# EAGLE design ZORRO-LAN-IDE (EAGLE 6.6.0)

## Sheet 1 of 2
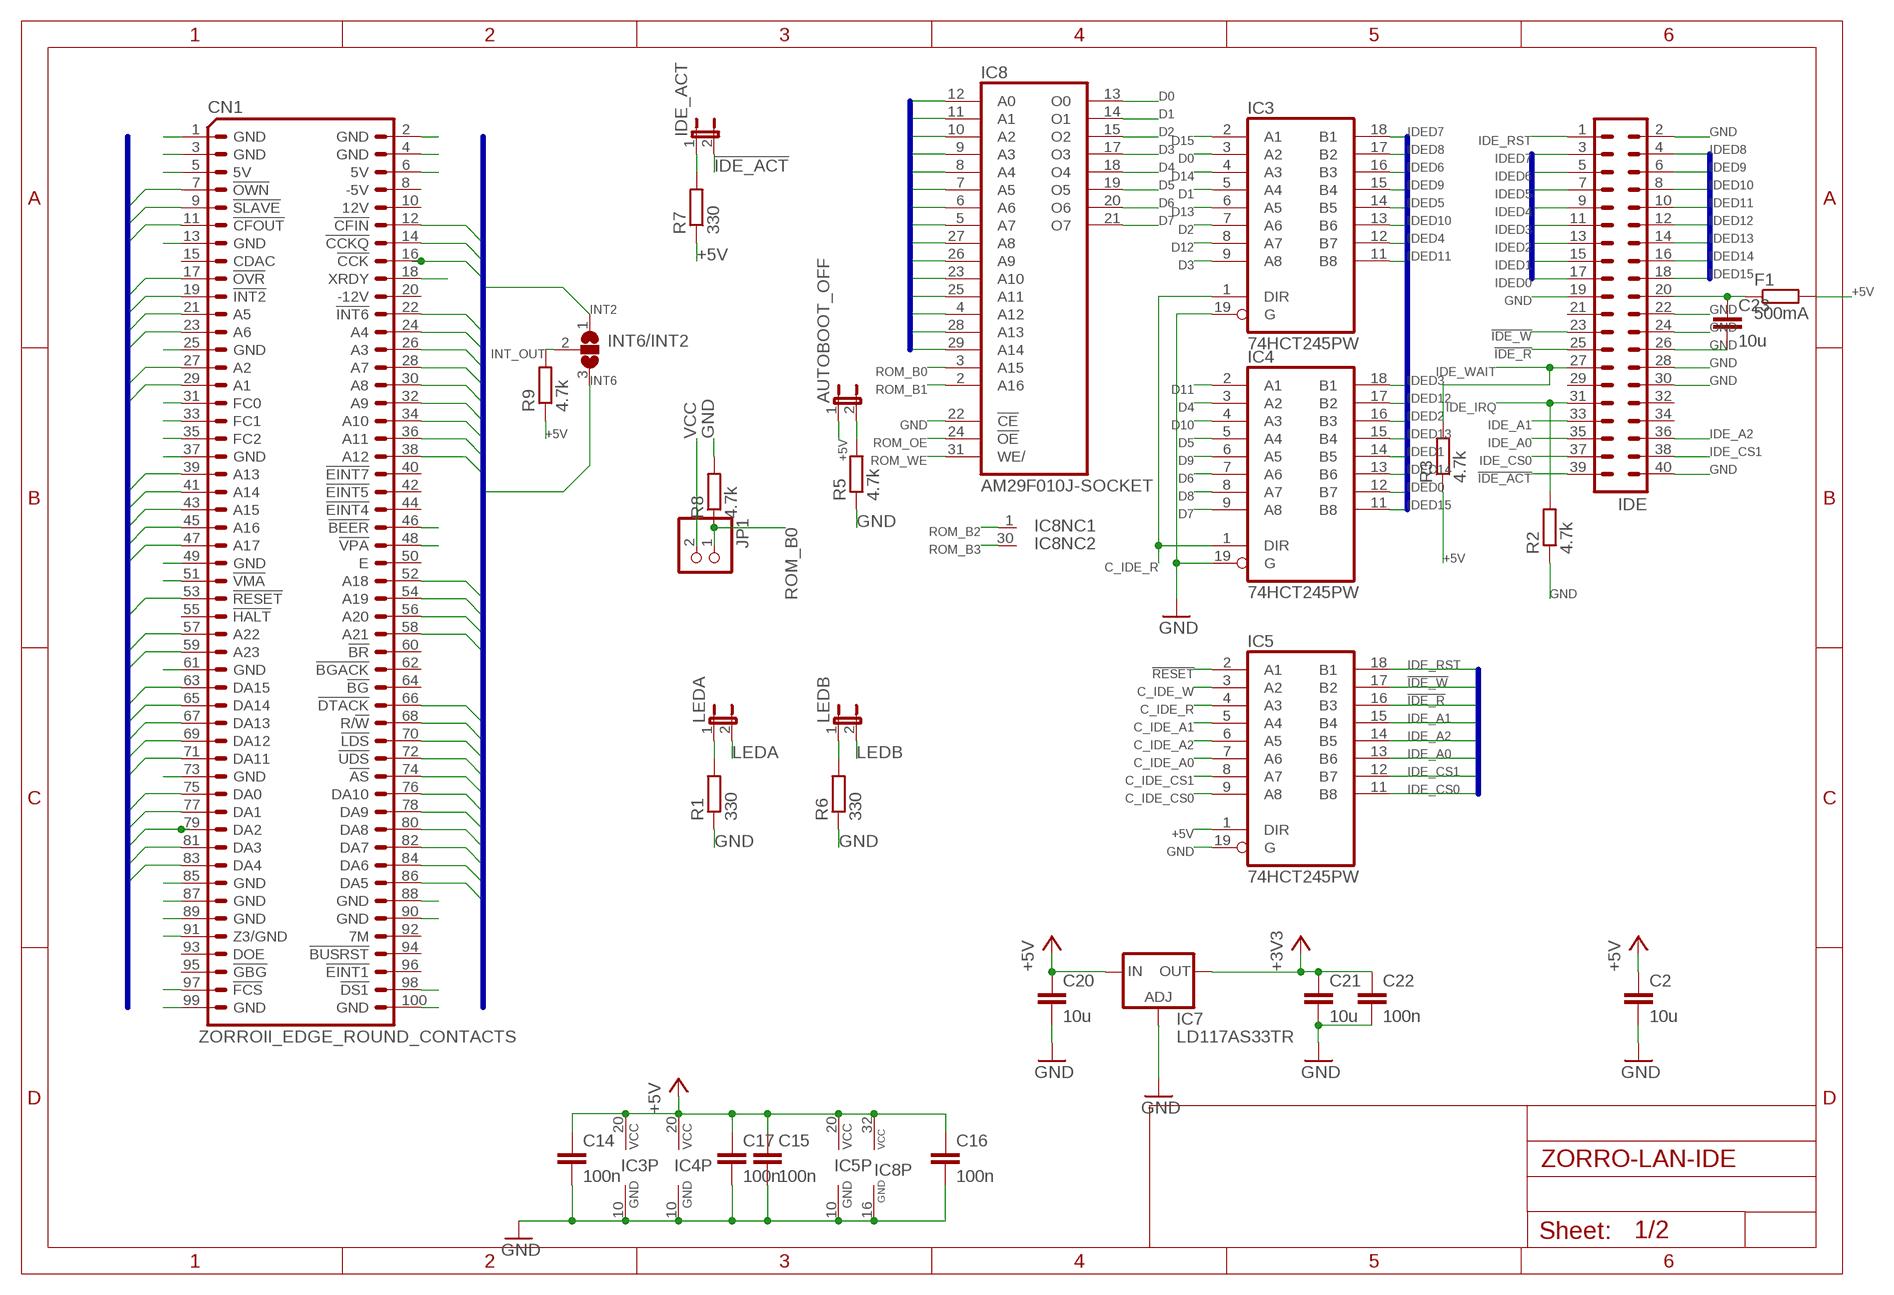
[diagram p0: schematic, sheet 1]

### Parts
AUTOBOOT_OFF  JP1E  [JP1]
C2  10u  C-EUC0805K  [C0805K]
C14  100n  C-EUC0603K  [C0603K]
C15  100n  C-EUC0603K  [C0603K]
C16  100n  C-EUC0603K  [C0603K]
C17  100n  C-EUC0603K  [C0603K]
C20  10u  C-EUC0805K  [C0805K]
C21  10u  C-EUC0805K  [C0805K]
C22  100n  C-EUC0603K  [C0603K]
C23  10u  C-EUC0805K  [C0805K]
CN1  ZORROII_EDGE_ROUND_CONTACTS  [LKONT_50_R]
F1  500mA  R-EU_R2512  [R2512]
IC3  74HCT245PW  [TSSOP20]
IC4  74HCT245PW  [TSSOP20]
IC5  74HCT245PW  [TSSOP20]
IC7  LD117AS33TR  [SOT223]
IC8  AM29F010J-SOCKET  [PLCC-32-SMT-TT]
IDE  ML40  [ML40]
IDE_ACT  JP1E  [JP1]
INT6/INT2  SJ2W  [SJ_2]
JP1  PINHD-1X02_2.54-S  [1X02-S]
LEDA  JP1E  [JP1]
LEDB  JP1E  [JP1]
R1  330  R-EU_R0603  [R0603]
R2  4.7k  R-EU_R0603  [R0603]
R3  4.7k  R-EU_R0603  [R0603]
R5  4.7k  R-EU_R0603  [R0603]
R6  330  R-EU_R0603  [R0603]
R7  330  R-EU_R0603  [R0603]
R8  4.7k  R-EU_R0603  [R0603]
R9  4.7k  R-EU_R0603  [R0603]

### Nets
!AS: CN1.74(!AS!) ; also sheet 2
!BERR: CN1.46(!BEER!) ; also sheet 2
!CFIN: CN1.12(!CFIN!) ; also sheet 2
!CFOUT: CN1.11(!CFOUT!) ; also sheet 2
!DS0: CN1.51(!VMA!) ; also sheet 2
!DS1: CN1.98(!DS1!) ; also sheet 2
!DTACK: CN1.66(!DTACK!) ; also sheet 2
!FCS: CN1.97(!FCS!) ; also sheet 2
!IDE_ACT: IDE.39 IDE_ACT.2
!IDE_R: IC5.16(B3) IDE.25
!IDE_W: IC5.17(B2) IDE.23
!LDS: CN1.70(!LDS!) ; also sheet 2
!MTACK: CN1.48(!VPA!) ; also sheet 2
!MTCR: CN1.18(XRDY) ; also sheet 2
!OVR: CN1.17(!OVR!) ; also sheet 2
!OWN: CN1.7(!OWN!) ; also sheet 2
!RESET: CN1.53(!RESET!) IC5.2(A1) ; also sheet 2
!SLAVE: CN1.9(!SLAVE!) ; also sheet 2
!UDS: CN1.72(!UDS!) ; also sheet 2
+3V3: C21.1 C22.1 IC7.2(OUT) IC7.4(OUT) ; also sheet 2
+5V: AUTOBOOT_OFF.1 C2.1 C14.1 C15.1 C16.1 C17.1 C20.1 CN1.5(5V) CN1.6(5V) F1.2 IC3.20(VCC) IC4.20(VCC) IC5.1(DIR) IC5.20(VCC) IC7.3(IN) IC8.32(VCC) R3.1 R7.1 R9.1 ; also sheet 2
A1: CN1.29(A1) IC8.12(A0) ; also sheet 2
A2: CN1.27(A2) IC8.11(A1) ; also sheet 2
A3: CN1.26(A3) IC8.10(A2) ; also sheet 2
A4: CN1.24(A4) IC8.9(A3) ; also sheet 2
A5: CN1.21(A5) IC8.8(A4) ; also sheet 2
A6: CN1.23(A6) IC8.7(A5) ; also sheet 2
A7: CN1.28(A7) IC8.6(A6) ; also sheet 2
A8: CN1.30(A8) IC8.5(A7) ; also sheet 2
A9: CN1.32(A9) IC8.27(A8) ; also sheet 2
A10: CN1.34(A10) IC8.26(A9) ; also sheet 2
A11: CN1.36(A11) IC8.23(A10) ; also sheet 2
A12: CN1.38(A12) IC8.25(A11) ; also sheet 2
A13: CN1.39(A13) IC8.4(A12) ; also sheet 2
A14: CN1.41(A14) IC8.28(A13) ; also sheet 2
A15: CN1.43(A15) IC8.29(A14) ; also sheet 2
A16: CN1.45(A16) ; also sheet 2
A17: CN1.47(A17) ; also sheet 2
A18: CN1.52(A18) ; also sheet 2
A19: CN1.54(A19) ; also sheet 2
A20: CN1.56(A20) ; also sheet 2
A21: CN1.58(A21) ; also sheet 2
A22: CN1.57(A22) ; also sheet 2
A23: CN1.59(A23) ; also sheet 2
AUTO_BOOT_OFF: AUTOBOOT_OFF.2 R5.2 ; also sheet 2
C1: CN1.14(!CCKQ!) ; also sheet 2
C3: CN1.16(!CCK!) ; also sheet 2
C_IDE_A0: IC5.7(A6) ; also sheet 2
C_IDE_A1: IC5.5(A4) ; also sheet 2
C_IDE_A2: IC5.6(A5) ; also sheet 2
C_IDE_CS0: IC5.9(A8) ; also sheet 2
C_IDE_CS1: IC5.8(A7) ; also sheet 2
C_IDE_R: IC3.1(DIR) IC4.1(DIR) IC5.4(A3) ; also sheet 2
C_IDE_W: IC5.3(A2) ; also sheet 2
D0: CN1.75(DA0) IC3.3(A2) IC8.13(O0) ; also sheet 2
D1: CN1.77(DA1) IC3.5(A4) IC8.14(O1) ; also sheet 2
D2: CN1.79(DA2) IC3.7(A6) IC8.15(O2) ; also sheet 2
D3: CN1.81(DA3) IC3.9(A8) IC8.17(O3) ; also sheet 2
D4: CN1.83(DA4) IC4.3(A2) IC8.18(O4) ; also sheet 2
D5: CN1.86(DA5) IC4.5(A4) IC8.19(O5) ; also sheet 2
D6: CN1.84(DA6) IC4.7(A6) IC8.20(O6) ; also sheet 2
D7: CN1.82(DA7) IC4.9(A8) IC8.21(O7) ; also sheet 2
D8: CN1.80(DA8) IC4.8(A7) ; also sheet 2
D9: CN1.78(DA9) IC4.6(A5) ; also sheet 2
D10: CN1.76(DA10) IC4.4(A3) ; also sheet 2
D11: CN1.71(DA11) IC4.2(A1) ; also sheet 2
D12: CN1.69(DA12) IC3.8(A7) ; also sheet 2
D13: CN1.67(DA13) IC3.6(A5) ; also sheet 2
D14: CN1.65(DA14) IC3.4(A3) ; also sheet 2
D15: CN1.63(DA15) IC3.2(A1) ; also sheet 2
FC0: CN1.31(FC0)
FC1: CN1.33(FC1)
FC2: CN1.35(FC2)
GND: C2.2 C14.2 C15.2 C16.2 C17.2 C20.2 C21.2 C22.2 C23.2 CN1.1(GND) CN1.2(GND) CN1.3(GND) CN1.4(GND) CN1.13(GND) CN1.25(GND) CN1.37(GND) CN1.49(GND) CN1.61(GND) CN1.73(GND) CN1.85(GND) CN1.87(GND) CN1.88(GND) CN1.89(GND) CN1.90(GND) CN1.99(GND) CN1.100(GND) IC3.10(GND) IC3.19(G) IC4.10(GND) IC4.19(G) IC5.10(GND) IC5.19(G) IC7.1(ADJ) IC8.16(GND) IC8.22(!CE) IDE.2 IDE.19 IDE.22 IDE.24 IDE.26 IDE.28 IDE.30 IDE.40 R1.1 R2.1 R5.1 R6.1 R8.2 ; also sheet 2
IDE_A0: IC5.13(B6) IDE.35
IDE_A1: IC5.15(B4) IDE.33
IDE_A2: IC5.14(B5) IDE.36
IDE_CS0: IC5.11(B8) IDE.37
IDE_CS1: IC5.12(B7) IDE.38
IDE_IRQ: IDE.31 R2.2 ; also sheet 2
IDE_RST: IC5.18(B1) IDE.1
IDE_WAIT: IDE.27 R3.2 ; also sheet 2
IDED0: IC4.12(B7) IDE.17
IDED1: IC4.14(B5) IDE.15
IDED2: IC4.16(B3) IDE.13
IDED3: IC4.18(B1) IDE.11
IDED4: IC3.12(B7) IDE.9
IDED5: IC3.14(B5) IDE.7
IDED6: IC3.16(B3) IDE.5
IDED7: IC3.18(B1) IDE.3
IDED8: IC3.17(B2) IDE.4
IDED9: IC3.15(B4) IDE.6
IDED10: IC3.13(B6) IDE.8
IDED11: IC3.11(B8) IDE.10
IDED12: IC4.17(B2) IDE.12
IDED13: IC4.15(B4) IDE.14
IDED14: IC4.13(B6) IDE.16
IDED15: IC4.11(B8) IDE.18
INT2: CN1.19(!INT2!) INT6/INT2.1
INT6: CN1.22(!INT6!) INT6/INT2.3
INT_OUT: INT6/INT2.2 R9.2 ; also sheet 2
KEY_PIN_POWER: C23.1 F1.1 IDE.20
LEDA: LEDA.2 ; also sheet 2
LEDB: LEDB.2 ; also sheet 2
N$1: LEDA.1 R1.2
N$2: LEDB.1 R6.2
N$42: IDE_ACT.1 R7.2
R/W: CN1.68(R/!W!) ; also sheet 2
ROM_B0: IC8.3(A15) JP1.1 R8.1 ; also sheet 2
ROM_B1: IC8.2(A16) ; also sheet 2
ROM_B2: IC8.1(NC) ; also sheet 2
ROM_B3: IC8.30(NC) ; also sheet 2
ROM_OE: IC8.24(!OE) ; also sheet 2
ROM_WE: IC8.31(WE/) ; also sheet 2
VCC: JP1.2
Z3: CN1.91(Z3/GND) ; also sheet 2
Unconnected: CN1.8(-5V) CN1.10(12V) CN1.15(CDAC) CN1.20(-12V) CN1.40(!EINT7!) CN1.42(!EINT5!) CN1.44(!EINT4!) CN1.50(E) CN1.55(!HALT!) CN1.60(!BR!) CN1.62(!BGACK!) CN1.64(!BG!) CN1.92(7M) CN1.93(DOE) CN1.94(!BUSRST!) CN1.95(!GBG!) CN1.96(!EINT1!) IDE.21 IDE.29 IDE.32 IDE.34

### Buses
IDED[0..15]
IDE_RST,IDE_A[0..2],IDE_CS[0..1],!IDE_R,!IDE_W
A[1..23]
A[1..31],D[0..15],C1,C3,!UDS,!LDS,!RESET,!AS,!DTACK,R/W,!OWN,!SLAVE,!CFIN,!CFOUT,!OVR,INT2,INT6
A[1..23],D[0..15],C1,C3,!UDS,!LDS,!RESET,!AS,!DTACK,R/W,!OWN,!SLAVE,!CFIN,!CFOUT,!OVR,INT2,INT6

## Sheet 2 of 2
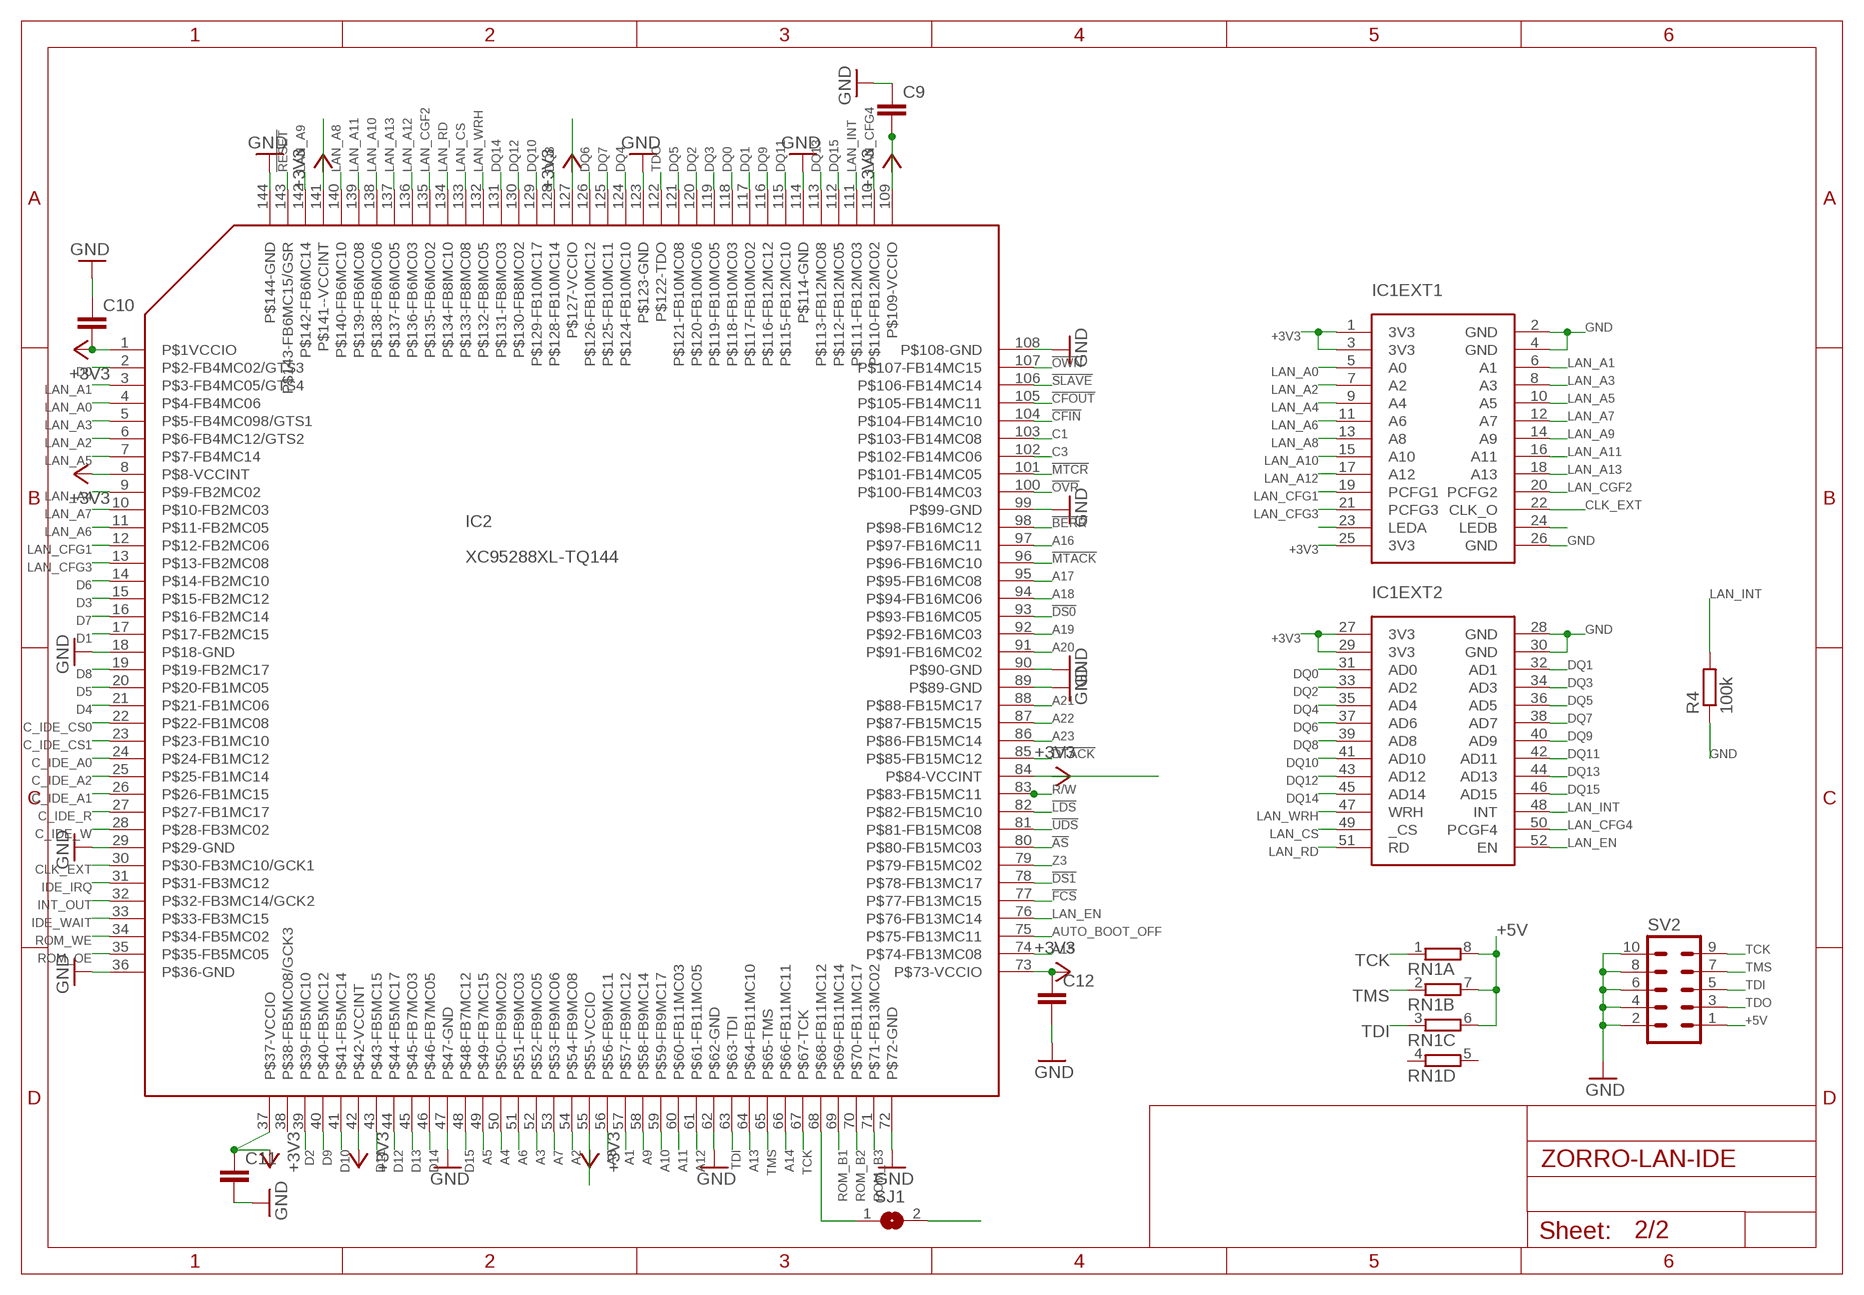
[diagram p1: schematic, sheet 2]

### Parts
C9  C-EUC0603K  [C0603K]
C10  C-EUC0603K  [C0603K]
C11  C-EUC0603K  [C0603K]
C12  C-EUC0603K  [C0603K]
IC1  OLIMEX_ENC  [OLIMEX-ENC624J600]
IC2  XC95288XL-TQ144  [TQFP144]
R4  100k  R-EU_R0603  [R0603]
RN1  4R-NCAY16  [CAY16]
SJ1  SJ  [SJ]
SV2  ML10L  [ML10L]

### Nets
!AS: IC2.80(P$80-FB15MC03) ; also sheet 1
!BERR: IC2.98(P$98-FB16MC12) ; also sheet 1
!CFIN: IC2.104(P$104-FB14MC10) ; also sheet 1
!CFOUT: IC2.105(P$105-FB14MC11) ; also sheet 1
!DS0: IC2.93(P$93-FB16MC05) ; also sheet 1
!DS1: IC2.78(P$78-FB13MC17) ; also sheet 1
!DTACK: IC2.85(P$85-FB15MC12) ; also sheet 1
!FCS: IC2.77(P$77-FB13MC15) ; also sheet 1
!LDS: IC2.82(P$82-FB15MC10) ; also sheet 1
!MTACK: IC2.96(P$96-FB16MC10) ; also sheet 1
!MTCR: IC2.101(P$101-FB14MC05) ; also sheet 1
!OVR: IC2.100(P$100-FB14MC03) ; also sheet 1
!OWN: IC2.107(P$107-FB14MC15) ; also sheet 1
!RESET: IC2.143(P$143-FB6MC15/GSR) ; also sheet 1
!SLAVE: IC2.106(P$106-FB14MC14) ; also sheet 1
!UDS: IC2.81(P$81-FB15MC08) ; also sheet 1
+3V3: C9.2 C10.2 C11.1 C12.1 IC1.1(EXT1:3V3) IC1.3(EXT1:3V3) IC1.25(EXT1:3V3) IC1.27(EXT2:3V3) IC1.29(EXT2:3V3) IC2.1(P$1VCCIO) IC2.8(P$8-VCCINT) IC2.37(P$37-VCCIO) IC2.42(P$42-VCCINT) IC2.55(P$55-VCCIO) IC2.73(P$73-VCCIO) IC2.84(P$84-VCCINT) IC2.109(P$109-VCCIO) IC2.127(P$127-VCCIO) IC2.141(P$141--VCCINT) ; also sheet 1
+5V: RN1.6 RN1.7 RN1.8 SV2.1 ; also sheet 1
A1: IC2.57(P$57-FB9MC12) ; also sheet 1
A2: IC2.54(P$54-FB9MC08) ; also sheet 1
A3: IC2.52(P$52-FB9MC05) ; also sheet 1
A4: IC2.50(P$50-FB9MC02) ; also sheet 1
A5: IC2.49(P$49-FB7MC15) ; also sheet 1
A6: IC2.51(P$51-FB9MC03) ; also sheet 1
A7: IC2.53(P$53-FB9MC06) ; also sheet 1
A8: IC2.56(P$56-FB9MC11) ; also sheet 1
A9: IC2.58(P$58-FB9MC14) ; also sheet 1
A10: IC2.59(P$59-FB9MC17) ; also sheet 1
A11: IC2.60(P$60-FB11MC03) ; also sheet 1
A12: IC2.61(P$61-FB11MC05) ; also sheet 1
A13: IC2.64(P$64-FB11MC10) ; also sheet 1
A14: IC2.66(P$66-FB11MC11) ; also sheet 1
A15: IC2.74(P$74-FB13MC08) ; also sheet 1
A16: IC2.97(P$97-FB16MC11) ; also sheet 1
A17: IC2.95(P$95-FB16MC08) ; also sheet 1
A18: IC2.94(P$94-FB16MC06) ; also sheet 1
A19: IC2.92(P$92-FB16MC03) ; also sheet 1
A20: IC2.91(P$91-FB16MC02) ; also sheet 1
A21: IC2.88(P$88-FB15MC17) ; also sheet 1
A22: IC2.87(P$87-FB15MC15) ; also sheet 1
A23: IC2.86(P$86-FB15MC14) ; also sheet 1
AUTO_BOOT_OFF: IC2.75(P$75-FB13MC11) ; also sheet 1
C1: IC2.103(P$103-FB14MC08) ; also sheet 1
C3: IC2.102(P$102-FB14MC06) ; also sheet 1
C_IDE_A0: IC2.24(P$24-FB1MC12) ; also sheet 1
C_IDE_A1: IC2.26(P$26-FB1MC15) ; also sheet 1
C_IDE_A2: IC2.25(P$25-FB1MC14) ; also sheet 1
C_IDE_CS0: IC2.22(P$22-FB1MC08) ; also sheet 1
C_IDE_CS1: IC2.23(P$23-FB1MC10) ; also sheet 1
C_IDE_R: IC2.27(P$27-FB1MC17) ; also sheet 1
C_IDE_W: IC2.28(P$28-FB3MC02) ; also sheet 1
CLK_EXT: IC1.22(EXT1:CLK_O) IC2.30(P$30-FB3MC10/GCK1)
D0: IC2.2(P$2-FB4MC02/GTS3) ; also sheet 1
D1: IC2.17(P$17-FB2MC15) ; also sheet 1
D2: IC2.39(P$39-FB5MC10) ; also sheet 1
D3: IC2.15(P$15-FB2MC12) ; also sheet 1
D4: IC2.21(P$21-FB1MC06) ; also sheet 1
D5: IC2.20(P$20-FB1MC05) ; also sheet 1
D6: IC2.14(P$14-FB2MC10) ; also sheet 1
D7: IC2.16(P$16-FB2MC14) ; also sheet 1
D8: IC2.19(P$19-FB2MC17) ; also sheet 1
D9: IC2.40(P$40-FB5MC12) ; also sheet 1
D10: IC2.41(P$41-FB5MC14) ; also sheet 1
D11: IC2.43(P$43-FB5MC15) ; also sheet 1
D12: IC2.44(P$44-FB5MC17) ; also sheet 1
D13: IC2.45(P$45-FB7MC03) ; also sheet 1
D14: IC2.46(P$46-FB7MC05) ; also sheet 1
D15: IC2.48(P$48-FB7MC12) ; also sheet 1
DQ0: IC1.31(EXT2:AD0) IC2.118(P$118-FB10MC03)
DQ1: IC1.32(EXT2:AD1) IC2.117(P$117-FB10MC02)
DQ2: IC1.33(EXT2:AD2) IC2.120(P$120-FB10MC06)
DQ3: IC1.34(EXT2:AD3) IC2.119(P$119-FB10MC05)
DQ4: IC1.35(EXT2:AD4) IC2.124(P$124-FB10MC10)
DQ5: IC1.36(EXT2:AD5) IC2.121(P$121-FB10MC08)
DQ6: IC1.37(EXT2:AD6) IC2.126(P$126-FB10MC12)
DQ7: IC1.38(EXT2:AD7) IC2.125(P$125-FB10MC11)
DQ8: IC1.39(EXT2:AD8) IC2.128(P$128-FB10MC14)
DQ9: IC1.40(EXT2:AD9) IC2.116(P$116-FB12MC12)
DQ10: IC1.41(EXT2:AD10) IC2.129(P$129-FB10MC17)
DQ11: IC1.42(EXT2:AD11) IC2.115(P$115-FB12MC10)
DQ12: IC1.43(EXT2:AD12) IC2.130(P$130-FB8MC02)
DQ13: IC1.44(EXT2:AD13) IC2.113(P$113-FB12MC08)
DQ14: IC1.45(EXT2:AD14) IC2.131(P$131-FB8MC03)
DQ15: IC1.46(EXT2:AD15) IC2.112(P$112-FB12MC05)
GND: C9.1 C10.1 C11.2 C12.2 IC1.2(EXT1:GND) IC1.4(EXT1:GND) IC1.26(EXT1:GND) IC1.28(EXT2:GND) IC1.30(EXT2:GND) IC2.18(P$18-GND) IC2.29(P$29-GND) IC2.36(P$36-GND) IC2.47(P$47-GND) IC2.62(P$62-GND) IC2.72(P$72-GND) IC2.89(P$89-GND) IC2.90(P$90-GND) IC2.99(P$99-GND) IC2.108(P$108-GND) IC2.114(P$114-GND) IC2.123(P$123-GND) IC2.144(P$144-GND) R4.1 SV2.2 SV2.4 SV2.6 SV2.8 SV2.10 ; also sheet 1
IDE_IRQ: IC2.31(P$31-FB3MC12) ; also sheet 1
IDE_WAIT: IC2.33(P$33-FB3MC15) ; also sheet 1
INT_OUT: IC2.32(P$32-FB3MC14/GCK2) ; also sheet 1
LAN_A0: IC1.5(EXT1:A0) IC2.4(P$4-FB4MC06)
LAN_A1: IC1.6(EXT1:A1) IC2.3(P$3-FB4MC05/GTS4)
LAN_A2: IC1.7(EXT1:A2) IC2.6(P$6-FB4MC12/GTS2)
LAN_A3: IC1.8(EXT1:A3) IC2.5(P$5-FB4MC098/GTS1)
LAN_A4: IC1.9(EXT1:A4) IC2.9(P$9-FB2MC02)
LAN_A5: IC1.10(EXT1:A5) IC2.7(P$7-FB4MC14)
LAN_A6: IC1.11(EXT1:A6) IC2.11(P$11-FB2MC05)
LAN_A7: IC1.12(EXT1:A7) IC2.10(P$10-FB2MC03)
LAN_A8: IC1.13(EXT1:A8) IC2.140(P$140-FB6MC10)
LAN_A9: IC1.14(EXT1:A9) IC2.142(P$142-FB6MC14)
LAN_A10: IC1.15(EXT1:A10) IC2.138(P$138-FB6MC06)
LAN_A11: IC1.16(EXT1:A11) IC2.139(P$139-FB6MC08)
LAN_A12: IC1.17(EXT1:A12) IC2.136(P$136-FB6MC03)
LAN_A13: IC1.18(EXT1:A13) IC2.137(P$137-FB6MC05)
LAN_CFG1: IC1.19(EXT1:PCFG1) IC2.12(P$12-FB2MC06)
LAN_CFG3: IC1.21(EXT1:PCFG3) IC2.13(P$13-FB2MC08)
LAN_CFG4: IC1.50(EXT2:PCGF4) IC2.110(P$110-FB12MC02)
LAN_CGF2: IC1.20(EXT1:PCFG2) IC2.135(P$135-FB6MC02)
LAN_CS: IC1.49(EXT2:_CS) IC2.133(P$133-FB8MC08)
LAN_EN: IC1.52(EXT2:EN) IC2.76(P$76-FB13MC14)
LAN_INT: IC1.48(EXT2:INT) IC2.111(P$111-FB12MC03) R4.2
LAN_RD: IC1.51(EXT2:RD) IC2.134(P$134-FB8MC10)
LAN_WRH: IC1.47(EXT2:WRH) IC2.132(P$132-FB8MC05)
LEDA: IC1.23(EXT1:LEDA) ; also sheet 1
LEDB: IC1.24(EXT1:LEDB) ; also sheet 1
N$40: IC2.68(P$68-FB11MC12) SJ1.1
R/W: IC2.83(P$83-FB15MC11) ; also sheet 1
ROM_B0: SJ1.2 ; also sheet 1
ROM_B1: IC2.69(P$69-FB11MC14) ; also sheet 1
ROM_B2: IC2.70(P$70-FB11MC17) ; also sheet 1
ROM_B3: IC2.71(P$71-FB13MC02) ; also sheet 1
ROM_OE: IC2.35(P$35-FB5MC05) ; also sheet 1
ROM_WE: IC2.34(P$34-FB5MC02) ; also sheet 1
TCK: IC2.67(P$67-TCK) RN1.1 SV2.9
TDI: IC2.63(P$63-TDI) RN1.3 SV2.5
TDO: IC2.122(P$122-TDO) SV2.3
TMS: IC2.65(P$65-TMS) RN1.2 SV2.7
Z3: IC2.79(P$79-FB15MC02) ; also sheet 1
Unconnected: IC2.38(P$38-FB5MC08/GCK3) RN1.4 RN1.5

## Library data of the parts
AUTOBOOT_OFF IDE_ACT LEDA LEDB = jumper:JP1E: JUMPER
C2 C9-C12 C14-C17 C20-C23 = rcl:C-EU: CAPACITOR, European symbol
CN1 = Amiga:ZORROII
F1 R1-R9 = rcl:R-EU_: RESISTOR, European symbol
IC1 = OLIMEX-ENJ:OLIMEX_ENC
IC2 = xilinx_xc9572xl-tq100:XC95288XL-TQ144
IC3-IC5 = 74xx-eu:74*245: Octal BUS TRANSCEIVER, 3-state
IC7 = v-reg:LD117A?*: Low drop fixed and adjustable positive voltage regulators 1 A Source: http://www.st.com/stonline/products/literature/ds/7194/ld1117axx.pdf
IC8 = am29-memory:AM29F010*: 1-Megabit FLASH MEMORY (128 K x 8 bit) 5 V-only
IDE = con-harting-ml:ML40: HARTING; OC_FARNELL: unknown; OC_NEWARK: unknown
INT6/INT2 = jumper:SJ2W: SMD solder JUMPER
JP1 = pinhead-2:PINHD-1X02: PIN HEADER
RN1 = resistor-dil:4R-N: Array Chip Resistor Source: RS Component / Phycomp; OC_FARNELL: unknown; OC_NEWARK: unknown
SJ1 = jumper:SJ: SMD solder JUMPER
SV2 = con-harting-ml:ML10: HARTING; OC_FARNELL: unknown; OC_NEWARK: unknown

## Board
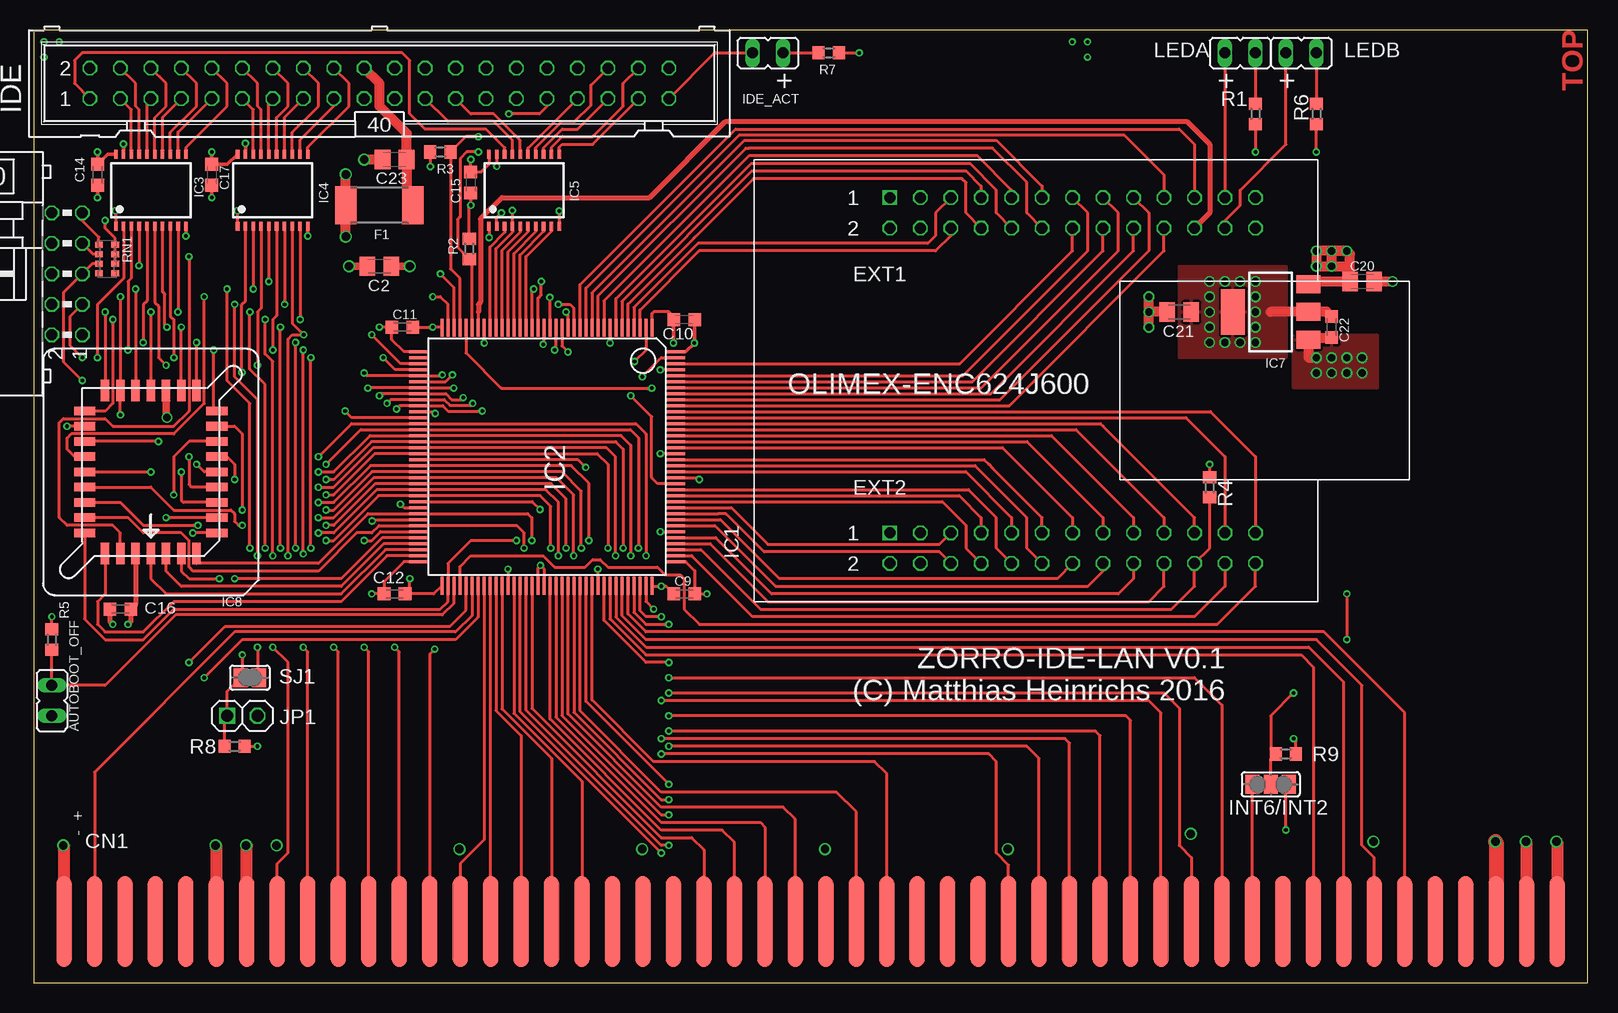
[diagram p2: board, top side]
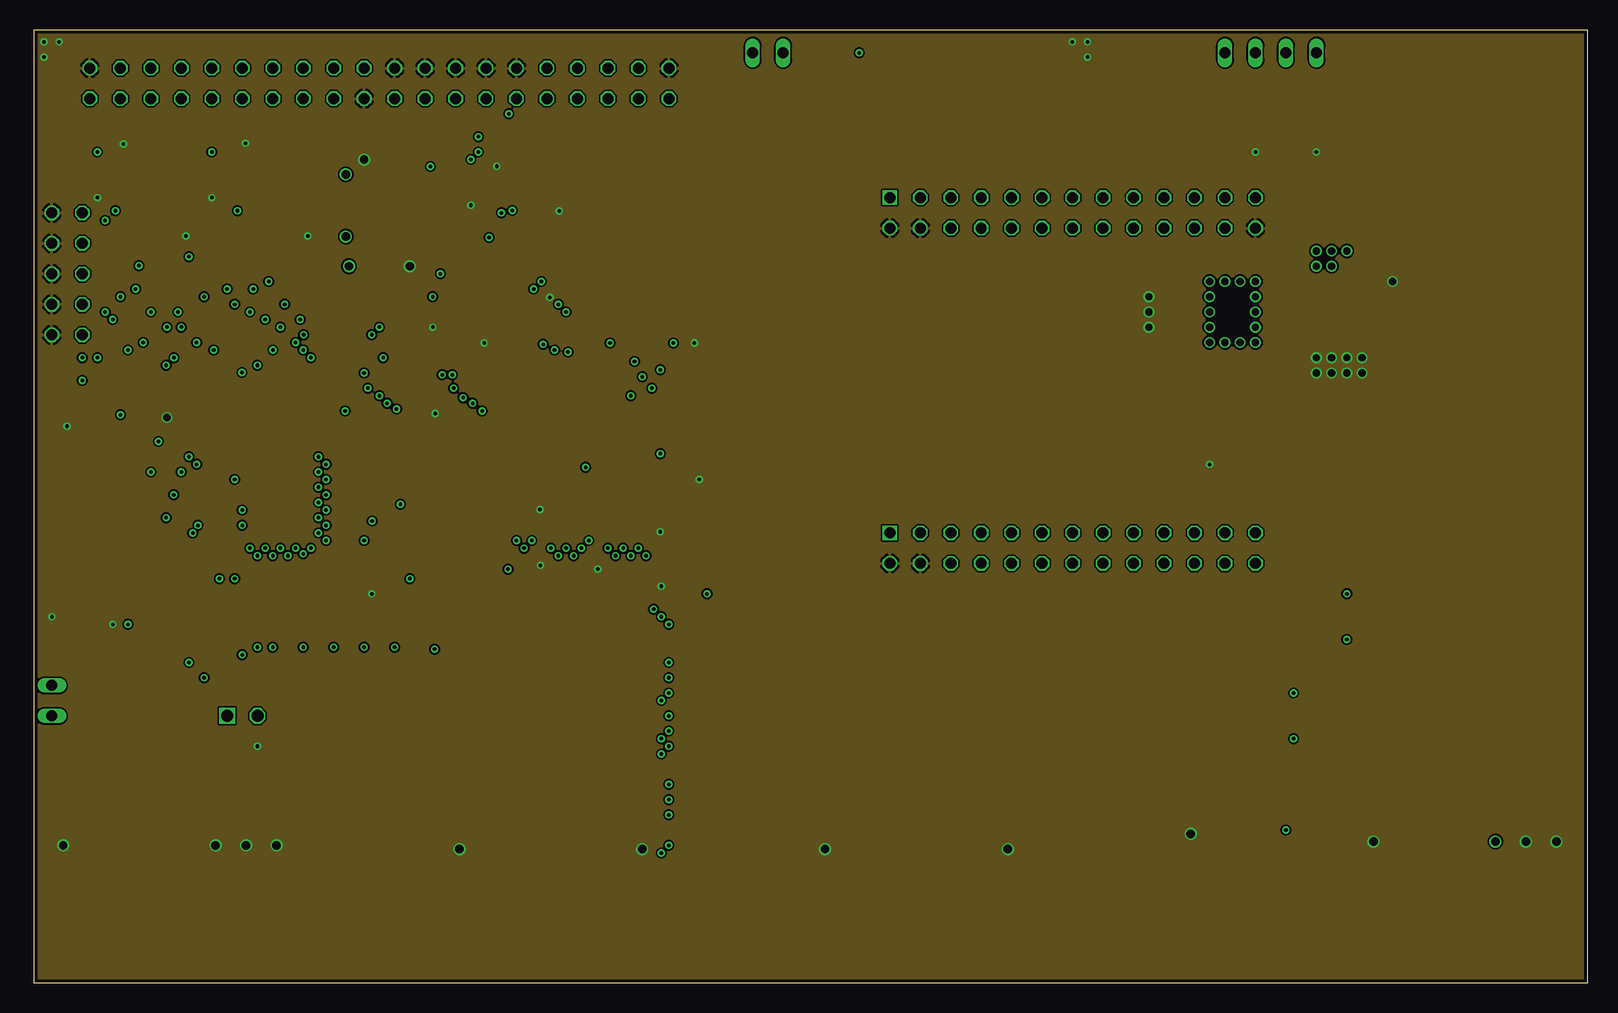
[diagram p3: board, inner layer Route2]
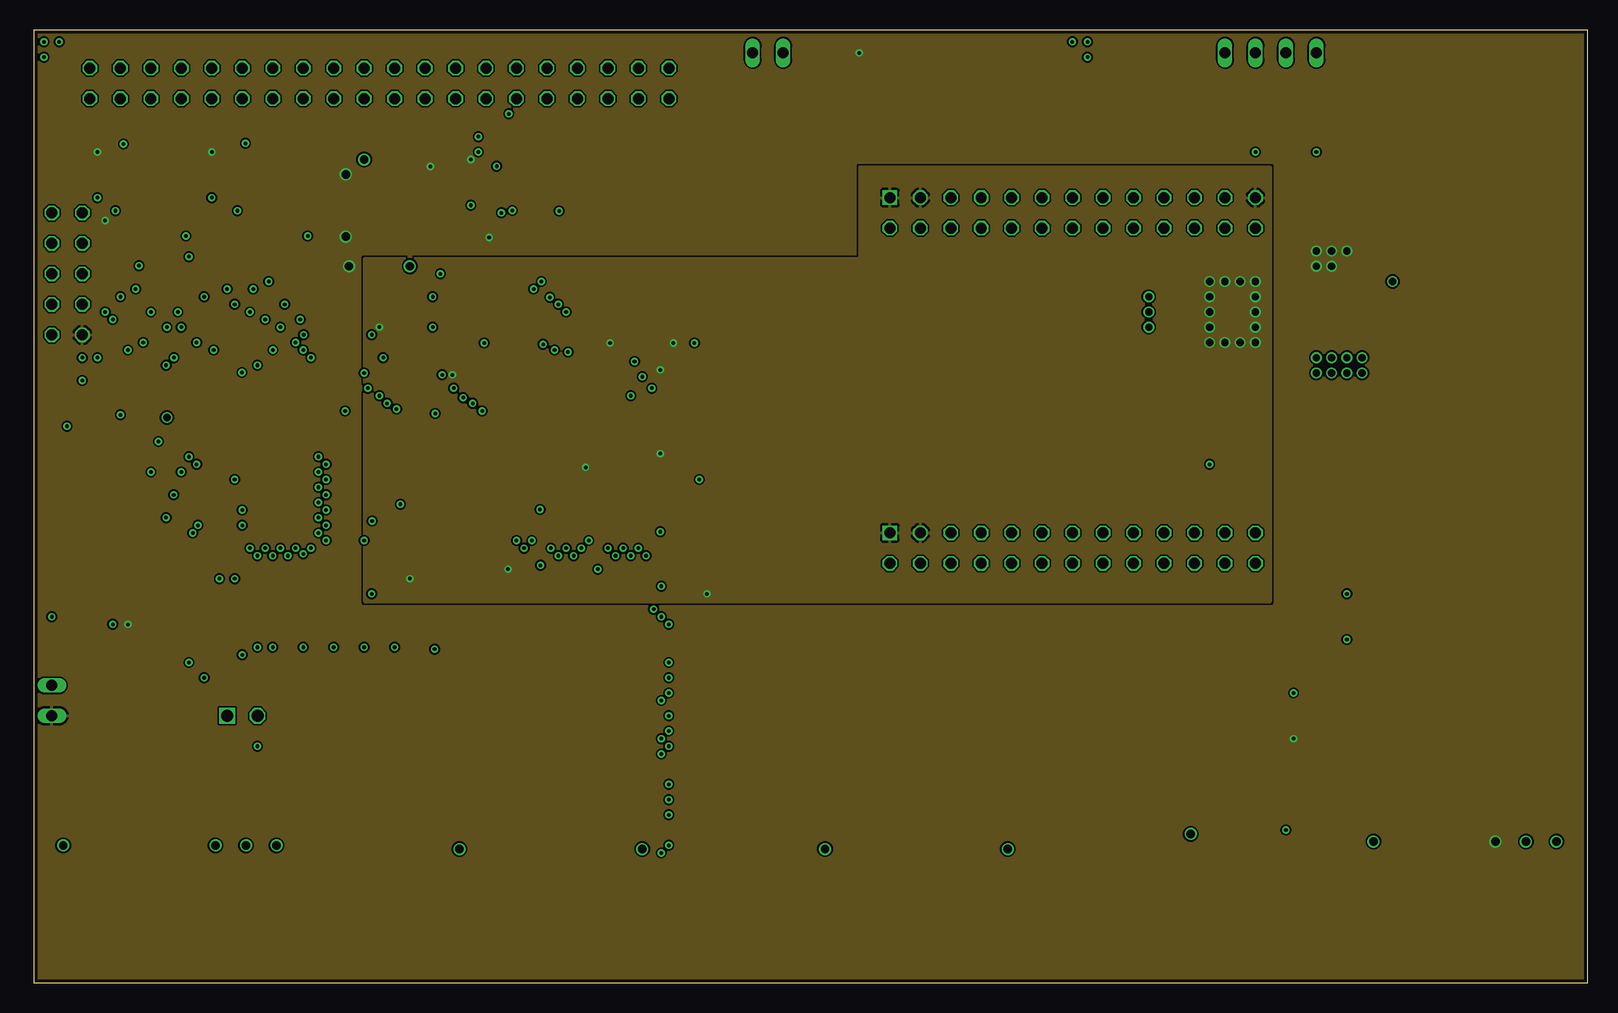
[diagram p4: board, inner layer Route15]
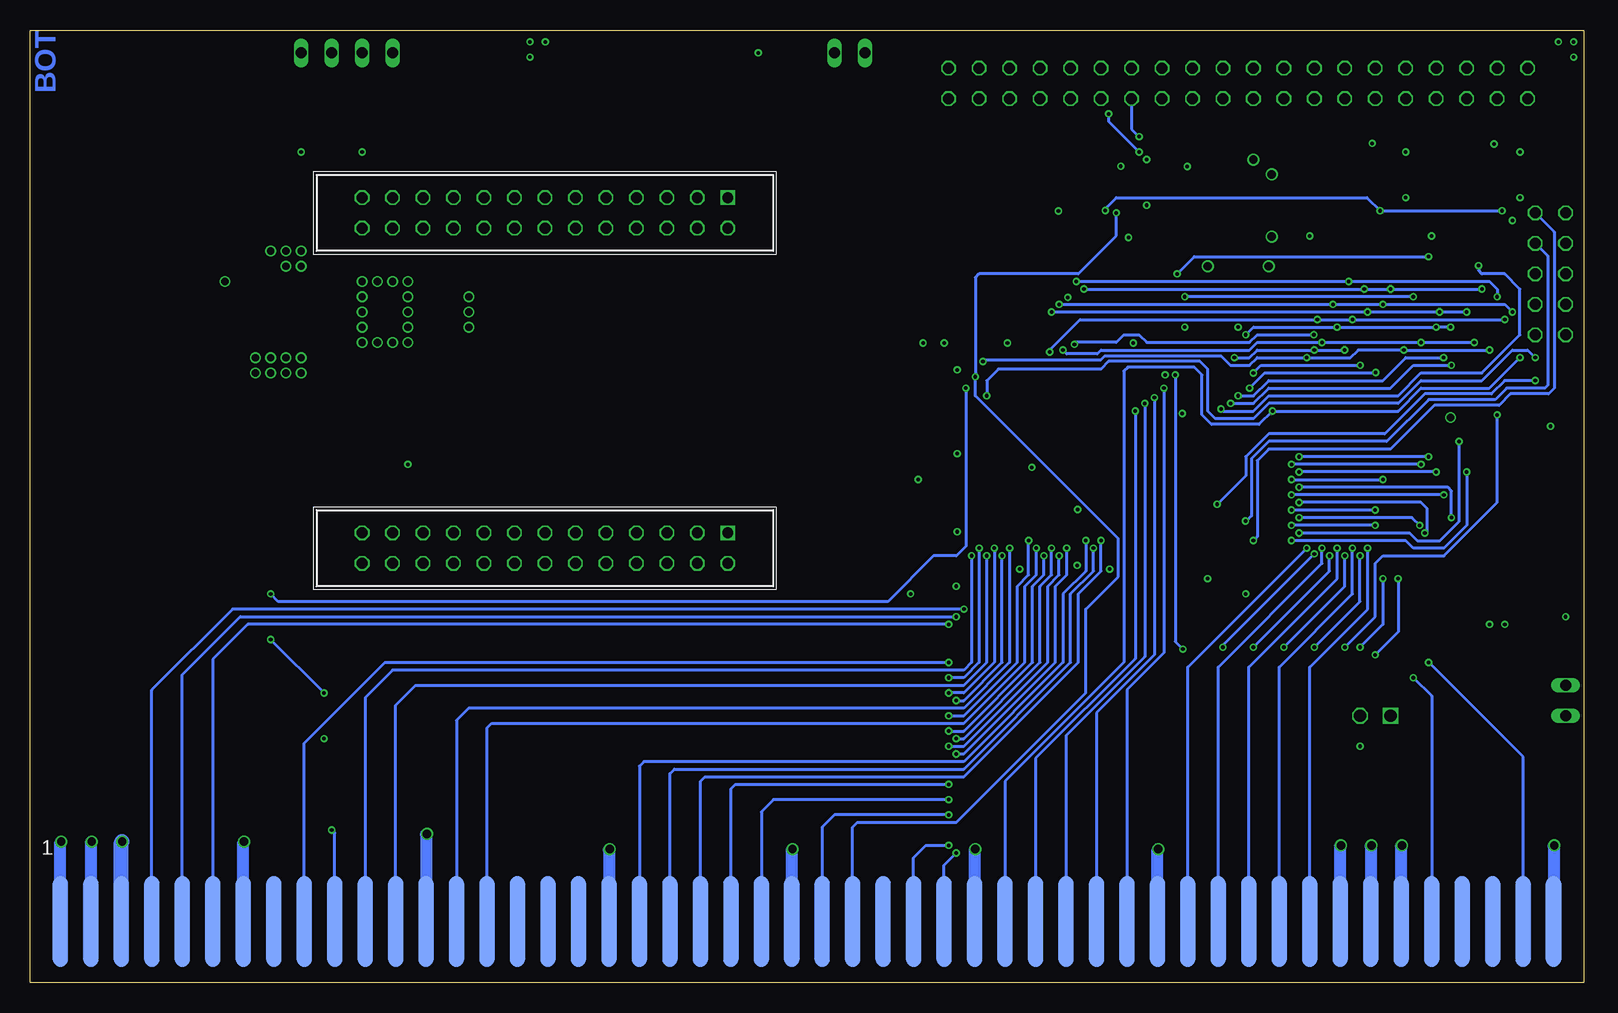
[diagram p5: board, bottom side, seen from below]

Size 129.54 x 79.36 mm. Coordinates in mm from the lower left corner, seen from the top.
Outline: 129.54,0 129.54,79.36 0,79.36 0,0 129.54,0
Copper layers (1+2*15+16): Top 0.035mm / dielectric 0.36mm / Route2 0.035mm / dielectric 0.71mm / Route15 0.035mm / dielectric 0.36mm / Bottom 0.035mm
Design rules "LeitOn - Standard-Eagle-DRU - 4-Lagen Multilayer - deutsch - Rev 2.0 *": minimum track width 0.15mm, minimum drill 0.3mm, track to track 0.15mm, track to pad 0.15mm, pad to pad 0.15mm, via to via 0.15mm, smd to smd 0.15mm, copper to edge 0.3mm, drill to drill 0.3mm, minimum pad ring 0.15mm, minimum via ring 0.15mm, stop-mask expansion 0.075mm, vias tented up to drill 0mil, thermal gap 0.2mm

### Footprints (pad centres in the part's own frame; a part is rotated, then mirrored left to right if it is on the bottom)
JP1 = drill 0.914 long: 1 0,-1.27; 2 0,1.27
C0805K = smd 1.3 x 1.6: 1 -1,0; 2 1,0
C0603K = smd 1.05 x 1.08: 1 -0.875,0; 2 0.875,0
LKONT_50_R = smd 1.27 x 7.62 bottom: 1 64.77,0; 3 62.23,0; 5 59.69,0; 7 57.15,0; 9 54.61,0; 11 52.07,0; 13 49.53,0; 15 46.99,0; 17 44.45,0; 19 41.91,0; 21 39.37,0; 23 36.83,0; 25 34.29,0; 27 31.75,0; 29 29.21,0; 31 26.67,0; 33 24.13,0; 35 21.59,0; 37 19.05,0; 39 16.51,0; 41 13.97,0; 43 11.43,0; 45 8.89,0; 47 6.35,0; 49 3.81,0; 51 1.27,0; 53 -1.27,0; 55 -3.81,0; 57 -6.35,0; 59 -8.89,0; 61 -11.43,0; 63 -13.97,0; 65 -16.51,0; 67 -19.05,0; 69 -21.59,0; 71 -24.13,0; 73 -26.67,0; 75 -29.21,0; 77 -31.75,0; 79 -34.29,0; 81 -36.83,0; 83 -39.37,0; 85 -41.91,0; 87 -44.45,0; 89 -46.99,0; 91 -49.53,0; 93 -52.07,0; 95 -54.61,0; 97 -57.15,0; 99 -59.69,0 | smd 1.27 x 7.62: 2 64.77,0; 4 62.23,0; 6 59.69,0; 8 57.15,0; 10 54.61,0; 12 52.07,0; 14 49.53,0; 16 46.99,0; 18 44.45,0; 20 41.91,0; 22 39.37,0; 24 36.83,0; 26 34.29,0; 28 31.75,0; 30 29.21,0; 32 26.67,0; 34 24.13,0; 36 21.59,0; 38 19.05,0; 40 16.51,0; 42 13.97,0; 44 11.43,0; 46 8.89,0; 48 6.35,0; 50 3.81,0; 52 1.27,0; 54 -1.27,0; 56 -3.81,0; 58 -6.35,0; 60 -8.89,0; 62 -11.43,0; 64 -13.97,0; 66 -16.51,0; 68 -19.05,0; 70 -21.59,0; 72 -24.13,0; 74 -26.67,0; 76 -29.21,0; 78 -31.75,0; 80 -34.29,0; 82 -36.83,0; 84 -39.37,0; 86 -41.91,0; 88 -44.45,0; 90 -46.99,0; 92 -49.53,0; 94 -52.07,0; 96 -54.61,0; 98 -57.15,0; 100 -59.69,0
R2512 = smd 1.8 x 3.2: 1 -2.8,0; 2 2.8,0
OLIMEX-ENC624J600 = drill 0.914 square: 1 35.56,2.54; 27 35.56,30.48 | drill 0.914 octagon: 2 35.56,5.08; 3 33.02,2.54; 4 33.02,5.08; 5 30.48,2.54; 6 30.48,5.08; 7 27.94,2.54; 8 27.94,5.08; 9 25.4,2.54; 10 25.4,5.08; 11 22.86,2.54; 12 22.86,5.08; 13 20.32,2.54; 14 20.32,5.08; 15 17.78,2.54; 16 17.78,5.08; 17 15.24,2.54; 18 15.24,5.08; 19 12.7,2.54; 20 12.7,5.08; 21 10.16,2.54; 22 10.16,5.08; 23 7.62,2.54; 24 7.62,5.08; 25 5.08,2.54; 26 5.08,5.08; 28 35.56,33.02; 29 33.02,30.48; 30 33.02,33.02; 31 30.48,30.48; 32 30.48,33.02; 33 27.94,30.48; 34 27.94,33.02; 35 25.4,30.48; 36 25.4,33.02; 37 22.86,30.48; 38 22.86,33.02; 39 20.32,30.48; 40 20.32,33.02; 41 17.78,30.48; 42 17.78,33.02; 43 15.24,30.48; 44 15.24,33.02; 45 12.7,30.48; 46 12.7,33.02; 47 10.16,30.48; 48 10.16,33.02; 49 7.62,30.48; 50 7.62,33.02; 51 5.08,30.48; 52 5.08,33.02
TQFP144 = smd 0.27 x 1.5: 1 -8.75,-10.75; 2 -8.25,-10.75; 3 -7.75,-10.75; 4 -7.25,-10.75; 5 -6.75,-10.75; 6 -6.25,-10.75; 7 -5.75,-10.75; 8 -5.25,-10.75; 9 -4.75,-10.75; 10 -4.25,-10.75; 11 -3.75,-10.75; 12 -3.25,-10.75; 13 -2.75,-10.75; 14 -2.25,-10.75; 15 -1.75,-10.75; 16 -1.25,-10.75; 17 -0.75,-10.75; 18 -0.25,-10.75; 19 0.25,-10.75; 20 0.75,-10.75; 21 1.25,-10.75; 22 1.75,-10.75; 23 2.25,-10.75; 24 2.75,-10.75; 25 3.25,-10.75; 26 3.75,-10.75; 27 4.25,-10.75; 28 4.75,-10.75; 29 5.25,-10.75; 30 5.75,-10.75; 31 6.25,-10.75; 32 6.75,-10.75; 33 7.25,-10.75; 34 7.75,-10.75; 35 8.25,-10.75; 36 8.75,-10.75; 73 8.75,10.75; 74 8.25,10.75; 75 7.75,10.75; 76 7.25,10.75; 77 6.75,10.75; 78 6.25,10.75; 79 5.75,10.75; 80 5.25,10.75; 81 4.75,10.75; 82 4.25,10.75; 83 3.75,10.75; 84 3.25,10.75; 85 2.75,10.75; 86 2.25,10.75; 87 1.75,10.75; 88 1.25,10.75; 89 0.75,10.75; 90 0.25,10.75; 91 -0.25,10.75; 92 -0.75,10.75; 93 -1.25,10.75; 94 -1.75,10.75; 95 -2.25,10.75; 96 -2.75,10.75; 97 -3.25,10.75; 98 -3.75,10.75; 99 -4.25,10.75; 100 -4.75,10.75; 101 -5.25,10.75; 102 -5.75,10.75; 103 -6.25,10.75; 104 -6.75,10.75; 105 -7.25,10.75; 106 -7.75,10.75; 107 -8.25,10.75; 108 -8.75,10.75 | smd 1.5 x 0.27: 37 10.75,-8.75; 38 10.75,-8.25; 39 10.75,-7.75; 40 10.75,-7.25; 41 10.75,-6.75; 42 10.75,-6.25; 43 10.75,-5.75; 44 10.75,-5.25; 45 10.75,-4.75; 46 10.75,-4.25; 47 10.75,-3.75; 48 10.75,-3.25; 49 10.75,-2.75; 50 10.75,-2.25; 51 10.75,-1.75; 52 10.75,-1.25; 53 10.75,-0.75; 54 10.75,-0.25; 55 10.75,0.25; 56 10.75,0.75; 57 10.75,1.25; 58 10.75,1.75; 59 10.75,2.25; 60 10.75,2.75; 61 10.75,3.25; 62 10.75,3.75; 63 10.75,4.25; 64 10.75,4.75; 65 10.75,5.25; 66 10.75,5.75; 67 10.75,6.25; 68 10.75,6.75; 69 10.75,7.25; 70 10.75,7.75; 71 10.75,8.25; 72 10.75,8.75; 109 -10.75,8.75; 110 -10.75,8.25; 111 -10.75,7.75; 112 -10.75,7.25; 113 -10.75,6.75; 114 -10.75,6.25; 115 -10.75,5.75; 116 -10.75,5.25; 117 -10.75,4.75; 118 -10.75,4.25; 119 -10.75,3.75; 120 -10.75,3.25; 121 -10.75,2.75; 122 -10.75,2.25; 123 -10.75,1.75; 124 -10.75,1.25; 125 -10.75,0.75; 126 -10.75,0.25; 127 -10.75,-0.25; 128 -10.75,-0.75; 129 -10.75,-1.25; 130 -10.75,-1.75; 131 -10.75,-2.25; 132 -10.75,-2.75; 133 -10.75,-3.25; 134 -10.75,-3.75; 135 -10.75,-4.25; 136 -10.75,-4.75; 137 -10.75,-5.25; 138 -10.75,-5.75; 139 -10.75,-6.25; 140 -10.75,-6.75; 141 -10.75,-7.25; 142 -10.75,-7.75; 143 -10.75,-8.25; 144 -10.75,-8.75
TSSOP20 = smd 0.3 x 0.75: 1 -2.925,-3; 2 -2.275,-3; 3 -1.625,-3; 4 -0.975,-3; 5 -0.325,-3; 6 0.325,-3; 7 0.975,-3; 8 1.625,-3; 9 2.275,-3; 10 2.925,-3; 11 2.925,3; 12 2.275,3; 13 1.625,3; 14 0.975,3; 15 0.325,3; 16 -0.325,3; 17 -0.975,3; 18 -1.625,3; 19 -2.275,3; 20 -2.925,3
SOT223 = smd 1.5 x 2: 1 -2.3,-3.15; 2 0,-3.15; 3 2.3,-3.15 | smd 3.8 x 2: 4 0,3.15
PLCC-32-SMT-TT = smd 0.71 x 1.78: 1 0,6.785; 2 -1.27,6.785; 3 -2.54,6.785; 4 -3.81,6.785; 14 -3.81,-6.785; 15 -2.54,-6.785; 16 -1.27,-6.785; 17 0,-6.785; 18 1.27,-6.785; 19 2.54,-6.785; 20 3.81,-6.785; 30 3.81,6.785; 31 2.54,6.785; 32 1.27,6.785 | smd 1.78 x 0.71: 5 -5.515,5.08; 6 -5.515,3.81; 7 -5.515,2.54; 8 -5.515,1.27; 9 -5.515,0; 10 -5.515,-1.27; 11 -5.515,-2.54; 12 -5.515,-3.81; 13 -5.515,-5.08; 21 5.515,-5.08; 22 5.515,-3.81; 23 5.515,-2.54; 24 5.515,-1.27; 25 5.515,0; 26 5.515,1.27; 27 5.515,2.54; 28 5.515,3.81; 29 5.515,5.08
ML40 = drill 0.914 octagon: 1 -24.13,-1.27; 2 -24.13,1.27; 3 -21.59,-1.27; 4 -21.59,1.27; 5 -19.05,-1.27; 6 -19.05,1.27; 7 -16.51,-1.27; 8 -16.51,1.27; 9 -13.97,-1.27; 10 -13.97,1.27; 11 -11.43,-1.27; 12 -11.43,1.27; 13 -8.89,-1.27; 14 -8.89,1.27; 15 -6.35,-1.27; 16 -6.35,1.27; 17 -3.81,-1.27; 18 -3.81,1.27; 19 -1.27,-1.27; 20 -1.27,1.27; 21 1.27,-1.27; 22 1.27,1.27; 23 3.81,-1.27; 24 3.81,1.27; 25 6.35,-1.27; 26 6.35,1.27; 27 8.89,-1.27; 28 8.89,1.27; 29 11.43,-1.27; 30 11.43,1.27; 31 13.97,-1.27; 32 13.97,1.27; 33 16.51,-1.27; 34 16.51,1.27; 35 19.05,-1.27; 36 19.05,1.27; 37 21.59,-1.27; 38 21.59,1.27; 39 24.13,-1.27; 40 24.13,1.27
SJ_2 = smd 1.168 x 1.6: 1 -1.524,0; 2 0,0; 3 1.524,0
1X02-S = drill 1.016 square: 1 -1.27,0 | drill 1.016 octagon: 2 1.27,0
R0603 = smd 1 x 1.1: 1 -0.85,0; 2 0.85,0
CAY16 = smd 0.5 x 0.65: 1 -1.2,-0.675; 2 -0.4,-0.675; 3 0.4,-0.675; 4 1.2,-0.675; 5 1.2,0.675; 6 0.4,0.675; 7 -0.4,0.675; 8 -1.2,0.675
SJ = smd 1.168 x 1.6: 1 -0.762,0; 2 0.762,0
ML10L = drill 0.914 octagon: 1 -5.08,-1.27; 2 -5.08,1.27; 3 -2.54,-1.27; 4 -2.54,1.27; 5 0,-1.27; 6 0,1.27; 7 2.54,-1.27; 8 2.54,1.27; 9 5.08,-1.27; 10 5.08,1.27

### Placement (x,y rotation side)
AUTOBOOT_OFF  1.52,23.5 0 top
C2  28.83,59.69 0 top
C9  54.23,32.38 0 top
C10  54.23,55.24 180 top
C11  30.73,54.61 0 top
C12  30.1,32.38 180 top
C14  5.33,67.31 270 top
C15  36.45,66.67 270 top
C16  7.24,31.11 180 top
C17  14.86,67.31 270 top
C20  110.74,58.42 0 top
C21  95.5,55.88 180 top
C22  108.2,54.61 270 top
C23  30.1,68.58 180 top
CN1  62.23,5.08 0 top
F1  28.83,64.77 180 top
IC1  106.93,67.94 180 top
IC2  42.8,43.81 180 top
IC3  9.78,66.04 0 top
IC4  19.94,66.04 0 top
IC5  40.89,66.04 0 top
IC7  103.12,55.88 90 top
IC8  9.78,42.55 180 top
IDE  28.83,74.93 0 top
IDE_ACT  61.21,77.47 90 top
INT6/INT2  103.12,16.51 180 top
JP1  17.4,22.23 0 top
LEDA  100.58,77.47 90 top
LEDB  105.66,77.47 90 top
R1  101.85,72.39 90 top
R2  36.32,61.14 270 top
R3  33.91,69.22 0 top
R4  98.04,41.27 270 top
R5  1.52,28.57 270 top
R6  106.93,72.39 90 top
R7  66.29,77.47 180 top
R8  16.76,19.68 0 top
R9  104.39,19.05 180 top
RN1  6.12,60.3 270 top
SJ1  18.03,25.4 180 top
SV2  2.79,59.05 90 top

### Tracks (layer width: path | path; a pad name or v marks a point on that pad's centre or on a via)
!AS
  Top 0.254: IC2.80 37.55,11.89 35.56,9.91 CN1.74
!BERR
  Top 0.254: CN1.46 71.12,17.4 70.1,18.41 51.69,18.41 46.55,23.55 IC2.98
!CFIN
  Top 0.254: CN1.12 114.3,22.48 107.57,29.21 51.05,29.21 49.55,30.71 IC2.104
!CFOUT  (via drill 0.3)
  Top 0.254: IC2.105 50.05,30.85 51.05,29.84 v52.96,29.84
  Bottom 0.254: v52.96,29.84 111.38,29.84 114.3,26.92 CN1.11
!DS0  (via drill 0.3)
  Top 0.254: IC2.93 44.05,22.25 52.32,13.97 v52.96,13.97
  Bottom 0.254: v52.96,13.97 62.48,13.97 63.5,12.95 CN1.51
!DS1
  Top 0.254: IC2.78 36.55,30.58 35.18,29.21 16.76,29.21 5.08,17.53 CN1.98
!DTACK
  Top 0.254: IC2.85 40.05,22.43 45.72,16.76 CN1.66
!FCS  (via drill 0.3)
  Top 0.254: v12.95,26.67 15.97,29.69 34.7,29.69 36.05,31.03 IC2.77
  Bottom 0.254: CN1.97 5.08,18.8 v12.95,26.67
!IDE_ACT
  Top 0.254: IDE.39 56.77,77.47 IDE_ACT.2
!IDE_R
  Top 0.254: IC5.16 40.57,70.17 38.35,72.39 36.45,72.39 IDE.25
!IDE_W
  Top 0.254: IC5.17 39.92,70.19 38.35,71.75 34.54,71.75 IDE.23
!LDS
  Top 0.254: IC2.82 38.55,22.66 40.64,20.57 CN1.70
!MTACK
  Top 0.254: CN1.48 68.58,14.22 66.93,15.88 52.32,15.88 45.55,22.65 IC2.96
!MTCR
  Top 0.254: IC2.101 48.05,30.31 51.05,27.3 105.66,27.3 106.68,26.29 CN1.18
!OVR  (via drill 0.3)
  Top 0.254: v52.96,26.67 51.05,26.67 47.55,30.18 IC2.100
  Bottom 0.254: CN1.17 106.68,19.94 99.95,26.67 v52.96,26.67
!OWN  (via drill 0.3)
  Top 0.254: IC2.107 51.05,31.75 v51.69,31.11
  Bottom 0.254: CN1.7 119.38,24.38 112.65,31.11 v51.69,31.11
!RESET  (via drill 0.3)
  Top 0.254: IC5.2 38.62,63.77 v38.99,64.14 | IC2.143 52.32,52.06 v50.74,50.48
  Bottom 0.254: v38.99,64.14 38.99,62.23 42.16,59.05 50.42,59.05 50.74,58.74 v50.74,50.48 50.74,48.9 38.83,36.99 38.83,33.81 41.53,31.11 41.53,24.13 52.32,13.34 60.58,13.34 60.96,12.95 CN1.53
!SLAVE  (via drill 0.3)
  Top 0.254: v52.32,30.48 51.05,30.48 50.55,30.98 IC2.106
  Bottom 0.254: CN1.9 116.84,25.65 112.01,30.48 v52.32,30.48
!UDS
  Top 0.254: IC2.81 38.05,5.13 CN1.72
+3V3  (via drill 0.3, 0.6)
  Top 0.254: IC2.141 52.26,51.06 v52.25,51.05 | IC2.8 v48.05,53.3 v48.06,53.29 | IC2.127 v52.25,44.06 v52.25,44.07 | v39.55,34.44 IC2.84 | IC2.1 51.55,55.74 51.69,55.88 52.96,55.88 53.35,55.48 C10.2 | IC2.42 34.33,50.06 v34.91,50.64 | IC2.37 30.87,52.56 29.86,53.58 C11.1 v28.83,54.61 | IC2.109 54.37,35.06 55.1,34.33 C9.2 v56.13,32.38 | v31.37,33.66 31.37,32.78 C12.1 33.37,32.38 IC2.73 | v46.03,42.93 45.39,43.56 IC2.55
  Top 0.305: C10.2 53.35,53.3 v53.34,53.29
  Top 0.813: 108.33,55.61 C22.1 107.78,55.91 107.78,55.88 IC7.2 103.12,55.88
  other vias: 100.58,58.42 99.31,58.42 98.04,58.42 98.04,57.15 98.04,55.88 98.04,54.61 98.04,53.34 99.31,53.34 100.58,53.34 101.85,53.34 101.85,54.61 101.85,55.88 101.85,57.15 101.85,58.42
  pour Top (isolate 0.254): 104.39,59.69 104.39,52.07 95.5,52.07 95.5,59.69
  pour Route15: 27.56,31.75 103.12,31.75 103.12,67.94 68.83,67.94 68.83,60.33 27.56,60.33
+5V  (via drill 0.3, 0.6, 0.7)
  Top 0.254: IC5.20 37.97,68.19 37.32,67.55 C15.1 v36.45,68.58 | IC5.1 v37.97,62.08 | R3.1 v33.06,68.01 v33.07,68 | R7.1 v68.83,77.47 | RN1.8 RN1.7 RN1.6 6.8,62.04 5.97,62.87 v5.97,63.5 | R9.1 105.24,20.11 v105.03,20.32
  Top 0.305: IC4.20 16.16,68.19 C17.1 v14.86,69.22 | v5.33,69.22 C14.1 6.19,69.04 IC3.20
  Top 0.406: IC8.32 8.51,31.51 C16.1 8.11,30.09 v7.87,29.84
  Top 0.61: C2.1 v26.29,59.69
  Top 0.813: 109.52,58.19 C20.1 | C20.1 109.74,60.69 v109.47,60.96 | IC7.3 106.27,58.42 C20.1 | v106.93,59.69 v108.2,59.69 v108.2,60.96 v109.47,60.96 | v109.47,60.96 v106.93,60.96 v106.93,59.69 | v106.93,59.69 109.47,59.69 | F1.2 26.03,67.33 v26.04,67.33 | v26.04,62.15 26.04,64.52 26.29,64.77
  Top 1.27: v121.86,11.75 121.92,11.68 CN1.5
  Bottom 1.27: CN1.5 121.92,11.68 v121.86,11.75
  pour Route15 (rank 2): -0.38,89.53 129.79,89.53 129.79,-0.64 -0.38,-0.64
A1  (via drill 0.3)
  Top 0.254: v24.38,39.37 25.02,39.37 28.21,42.56 IC2.57 44.05,42.56 45.66,40.96 v45.66,36.2 | IC8.12 16.76,46.35 17.4,45.72 v17.4,39.37
  Bottom 0.254: v17.4,39.37 v24.38,39.37 | CN1.29 91.44,21.21 91.06,21.59 51.69,21.59 46.61,26.67 46.61,33.02 45.66,33.97 v45.66,36.2
A2  (via drill 0.3)
  Top 0.254: v24.38,40.64 25.02,40.64 28.44,44.06 IC2.54 46.99,44.06 47.88,43.18 v47.88,36.2 | IC8.11 12.95,45.09 11.68,43.81 v11.68,40.64
  Bottom 0.254: v11.68,40.64 v24.38,40.64 | v47.88,36.2 47.88,26.67 51.69,22.86 92.96,22.86 93.98,21.84 CN1.27
A3  (via drill 0.3)
  Top 0.254: v24.38,41.91 25.02,41.91 28.17,45.06 IC2.52 48.53,45.06 49.15,44.45 v49.15,36.2 | IC8.10 16.13,43.81 16.76,43.18 v16.76,41.91 | v52.96,24.13 94.23,24.13 95.5,22.86 95.5,11.43 96.52,10.41 CN1.26
  Bottom 0.254: v24.38,41.91 v16.76,41.91 | v49.15,36.2 49.15,26.67 51.69,24.13 v52.96,24.13
A4  (via drill 0.3)
  Top 0.254: v24.38,43.18 27.27,46.06 IC2.50 49.76,46.06 50.42,45.4 v50.42,36.2 | IC8.9 14.22,42.55 v13.59,43.18 | v52.96,25.4 96.77,25.4 99.06,23.11 CN1.24
  Bottom 0.254: v13.59,43.18 v24.38,43.18 | v50.42,36.2 50.42,26.67 51.69,25.4 v52.96,25.4
A5  (via drill 0.3)
  Top 0.254: v23.75,43.81 26.5,46.56 IC2.49 50.21,46.56 51.05,45.72 v51.05,35.56 | IC8.8 13.2,41.27 12.95,41.52 v12.95,43.81
  Bottom 0.254: v12.95,43.81 v23.75,43.81 | v51.05,35.56 51.05,26.67 51.69,26.04 99.31,26.04 101.6,23.75 CN1.21
A6  (via drill 0.3)
  Top 0.254: v23.75,42.55 25.02,42.55 28.04,45.56 IC2.51 48.99,45.56 49.78,44.77 v49.78,35.56 | IC8.7 12.48,40.01 12.32,40.16 v12.32,42.55
  Bottom 0.254: v12.32,42.55 v23.75,42.55 | CN1.23 99.06,23.11 97.41,24.77 51.69,24.77 49.78,26.67 v49.78,35.56
A7  (via drill 0.3)
  Top 0.254: v23.75,41.27 25.02,41.27 28.31,44.56 IC2.53 47.76,44.56 48.51,43.81 v48.51,35.56 | IC8.6 v11.05,38.73 | CN1.28 93.98,22.48 92.96,23.5 v52.32,23.5
  Bottom 0.254: v11.05,38.73 11.05,40.96 11.37,41.27 v23.75,41.27 | v52.32,23.5 51.69,23.5 48.51,26.67 v48.51,35.56
A8  (via drill 0.3)
  Top 0.254: v23.75,40.01 25.02,40.01 28.08,43.06 IC2.56 44.82,43.06 46.29,41.59 v46.29,36.83 | IC8.5 v13.27,37.47 | CN1.30 91.44,21.84 91.06,22.23 v52.96,22.23
  Bottom 0.254: v23.75,40.01 13.59,40.01 13.11,39.53 13.11,37.62 v13.27,37.47 | v52.96,22.23 51.69,22.23 47.24,26.67 47.24,33.02 46.29,33.97 v46.29,36.83
A9  (via drill 0.3)
  Top 0.254: v23.75,38.73 25.02,38.73 28.35,42.06 IC2.58 43.6,42.06 45.02,40.64 v45.02,35.56 | IC8.27 7.24,40.01 9.14,38.1 v13.7,38.1 | CN1.32 88.9,20.57 88.52,20.95 v52.96,20.95
  Bottom 0.254: v23.75,38.73 14.33,38.73 v13.7,38.1 | v52.96,20.95 51.69,20.95 45.97,26.67 45.97,33.02 45.02,33.97 v45.02,35.56
A10  (via drill 0.3)
  Top 0.254: v24.38,38.1 25.02,38.1 28.48,41.56 IC2.59 43.14,41.56 44.39,40.32 v44.39,36.2 | IC8.26 9.78,41.27 11.68,39.37 16.45,39.37 16.76,39.05 16.76,38.42 17.08,38.1 v17.4,38.1 | CN1.34 86.36,19.94 85.98,20.32 v52.32,20.32
  Bottom 0.254: v17.4,38.1 v24.38,38.1 | v52.32,20.32 51.69,20.32 45.34,26.67 45.34,33.02 44.39,33.97 v44.39,36.2
A11  (via drill 0.3)
  Top 0.254: CN1.36 83.82,18.67 82.8,19.68 v52.96,19.68 | v43.75,35.56 43.75,40.01 42.69,41.06 IC2.60 28.62,41.06 25.02,37.47 v23.75,37.47 | v10.41,45.09 IC8.23
  Bottom 0.254: v52.96,19.68 51.69,19.68 44.7,26.67 44.7,33.02 43.75,33.97 v43.75,35.56 | v23.75,37.47 14.54,37.47 13.91,36.83 12,36.83 10.41,38.42 v10.41,45.09
A12  (via drill 0.3)
  Top 0.254: IC8.25 v9.78,42.55 | CN1.38 81.28,9.78 80.26,10.79 80.26,18.41 79.63,19.05 v52.32,19.05 | v43.12,36.2 43.12,39.69 42.24,40.56 IC2.61 28.75,40.56 25.02,36.83 v24.38,36.83
  Bottom 0.254: v52.32,19.05 51.69,19.05 44.07,26.67 44.07,33.02 43.12,33.97 v43.12,36.2 | v9.78,42.55 9.78,38.1 11.68,36.2 14.22,36.2 14.86,36.83 v24.38,36.83
A13  (via drill 0.3)
  Top 0.254: v41.53,36.83 41.53,38.73 41.2,39.06 IC2.64 27.89,39.06 23.75,34.92 13.59,34.92 IC8.4
  Bottom 0.254: v41.53,36.83 41.53,34.29 43.43,32.38 43.43,26.67 51.69,18.41 78.36,18.41 78.74,18.03 CN1.39
A14  (via drill 0.3)
  Top 0.254: IC8.28 7.87,38.73 9.14,37.47 12.32,37.47 12.95,36.83 12.95,34.62 13.28,34.29 23.75,34.29 26.92,37.47 28.19,37.47 28.79,38.06 IC2.66 40.29,38.06 40.89,37.47 v40.89,36.2
  Bottom 0.254: CN1.41 76.2,17.4 75.82,17.78 51.69,17.78 42.8,26.67 42.8,32.38 40.89,34.29 v40.89,36.2
A15  (via drill 0.3)
  Top 0.254: IC8.29 4.26,30.28 5.97,28.57 9.14,28.57 11.68,31.11 33.91,31.11 34.54,31.75 IC2.74 34.55,34.93 36.45,36.83 v40.26,36.83
  Bottom 0.254: CN1.43 73.66,16.76 73.28,17.14 51.69,17.14 42.16,26.67 42.16,32.38 40.26,34.29 v40.26,36.83
A16  (via drill 0.3)
  Top 0.254: v52.96,16.51 46.05,23.42 IC2.97
  Bottom 0.254: CN1.45 71.12,16.13 70.74,16.51 v52.96,16.51
A17  (via drill 0.3)
  Top 0.254: IC2.95 45.05,22.52 52.32,15.24 v52.96,15.24
  Bottom 0.254: v52.96,15.24 67.56,15.24 68.58,14.22 CN1.47
A18
  Top 0.254: CN1.52 63.5,13.59 62.48,14.61 52.32,14.61 44.55,22.38 IC2.94
A19
  Top 0.254: IC2.92 43.55,22.11 52.32,13.34 60.58,13.34 60.96,12.95 CN1.54
A20
  Top 0.254: CN1.56 58.42,11.68 57.4,12.7 52.32,12.7 43.05,21.98 IC2.91
A21
  Top 0.254: IC2.88 41.55,22.84 52.32,12.06 54.86,12.06 55.88,11.05 CN1.58
A22  (via drill 0.3)
  Top 0.254: v52.96,11.43 52.32,11.43 41.05,22.7 IC2.87
  Bottom 0.254: CN1.57 55.88,10.41 54.86,11.43 v52.96,11.43
A23  (via drill 0.3)
  Top 0.254: v52.32,10.79 40.55,22.57 IC2.86
  Bottom 0.254: CN1.59 53.34,9.78 v52.32,10.79
AUTO_BOOT_OFF
  Top 0.254: R5.2 AUTOBOOT_OFF.2 5.97,24.77 11.84,30.64 34.07,30.64 35.05,31.62 IC2.75
C1
  Top 0.254: CN1.14 111.76,10.41 110.74,11.43 110.74,24.77 106.93,28.57 51.05,28.57 49.05,30.58 IC2.103
C3
  Top 0.254: IC2.102 48.55,30.45 51.05,27.94 106.3,27.94 109.22,25.02 CN1.16
C_IDE_A0
  Top 0.254: IC5.7 41.87,62.57 40.05,60.75 IC2.24
C_IDE_A1
  Top 0.254: IC5.5 40.57,62.54 39.05,61.02 IC2.26
C_IDE_A2
  Top 0.254: IC5.6 41.22,62.55 39.55,60.88 IC2.25
C_IDE_CS0
  Top 0.254: IC5.9 43.17,62.6 41.05,60.48 IC2.22
C_IDE_CS1
  Top 0.254: IC2.23 40.55,60.62 42.52,62.59 IC5.8
C_IDE_R  (via drill 0.3)
  Top 0.254: v6.83,64.31 6.83,63.02 IC3.1 | IC2.27 38.55,61.16 39.92,62.52 IC5.4 39.92,64.32 v39.9,64.34 | IC4.1 17.01,64.29 v16.99,64.31
  Bottom 0.254: v6.83,64.31 v16.99,64.31 18.09,65.41 38.99,65.41 39.9,64.49 v39.9,64.34
C_IDE_W
  Top 0.254: IC5.3 39.27,62.51 38.05,61.29 IC2.28
CLK_EXT
  Top 0.254: 37.08,55.88 37.05,55.84 IC2.30
  Top 0.406: 37.08,55.88 37.08,56.52 37.26,56.69 37.26,63.63 39.04,65.41 51.33,65.41 57.68,71.75 96.14,71.75 98.04,69.85 98.04,64.14 IC1.22
D0  (via drill 0.3)
  Top 0.254: IC3.3 8.15,58.7 7.87,58.42 v7.87,52.7 | IC8.13 15.02,47.9 v15.02,52.7 | v23.11,36.2 v23.11,52.07 | IC2.2 51.05,52.7 v50.1,51.75
  Bottom 0.254: v7.87,52.7 v15.02,52.7 18.83,52.7 19.46,52.07 v23.11,52.07 27.24,52.07 27.88,51.44 29.46,51.44 30.26,52.23 39.94,52.23 40.26,51.91 49.94,51.91 v50.1,51.75 | CN1.75 33.02,26.29 v23.11,36.2
D1  (via drill 0.3)
  Top 0.254: IC8.14 v13.59,53.34 | IC3.5 9.45,56.83 9.14,56.52 v9.14,53.34 | v21.84,36.2 v21.84,53.34 | v43.43,52.7 43.55,52.82 IC2.17
  Bottom 0.254: v9.14,53.34 v13.59,53.34 v21.84,53.34 27.24,53.34 27.88,52.7 40.26,52.7 40.58,52.39 43.12,52.39 v43.43,52.7 | CN1.77 30.48,26.29 21.84,34.92 v21.84,36.2
D2  (via drill 0.3)
  Top 0.254: IC8.15 v12.32,54.61 | IC2.39 30.6,51.56 v28.19,53.98 | v11.13,54.61 10.95,54.79 10.95,57.35 10.75,57.55 IC3.7 | v20.57,36.2 v20.57,54.61
  Bottom 0.254: v11.13,54.61 v12.32,54.61 v20.57,54.61 27.56,54.61 v28.19,53.98 | CN1.79 27.94,26.29 20.57,33.66 v20.57,36.2
D3  (via drill 0.3)
  Top 0.254: v9.78,55.88 IC8.17 | IC3.9 12.05,55.89 v12.04,55.88 | v19.3,36.2 19.3,49.85 18.03,51.12 v18.03,55.88 | IC2.15 44.55,55.72 v44.39,55.88
  Bottom 0.254: v44.39,55.88 v18.03,55.88 v12.04,55.88 v9.78,55.88 | CN1.81 25.4,26.29 19.3,32.38 v19.3,36.2
D4  (via drill 0.3)
  Top 0.254: v8.51,57.78 IC8.18 | IC4.3 v18.31,57.79 v18.31,57.78 | v18.03,36.2 18.03,48.26 16.13,50.16 v16.13,57.78 | IC2.21 41.55,57.65 v41.69,57.78
  Bottom 0.254: v41.69,57.78 v18.31,57.78 v16.13,57.78 v8.51,57.78 | CN1.83 22.86,26.29 18.03,31.11 v18.03,36.2
D5  (via drill 0.3)
  Top 0.254: v7.24,57.15 IC8.19 v7.24,47.31 | IC4.5 v19.61,58.42 | CN1.86 20.32,9.91 21.21,10.79 21.21,26.67 v19.94,27.94 | IC2.20 42.05,57.03 42.32,57.31 v42.32,58.42
  Bottom 0.254: v42.32,58.42 v19.61,58.42 7.87,58.42 7.24,57.78 v7.24,57.15 | v7.24,47.31 7.24,40.01 11.68,35.56 16.76,35.56 17.4,34.92 17.4,30.48 v19.94,27.94
D6  (via drill 0.3)
  Top 0.254: v5.97,55.88 IC8.20 | IC4.7 20.91,56.53 v20.93,56.52 | CN1.84 22.86,27.56 v22.48,27.94 | v18.67,35.56 18.67,48.58 16.76,50.48 v16.76,56.52 | IC2.14 45.05,56.17 44.7,56.52 v43.75,56.52
  Bottom 0.254: v43.75,56.52 v20.93,56.52 v16.76,56.52 6.6,56.52 v5.97,55.88 | v22.48,27.94 18.67,31.75 v18.67,35.56
D7  (via drill 0.3)
  Top 0.254: v6.6,55.24 6.6,48.26 5.97,47.62 IC8.21 | IC4.9 22.21,55.26 v22.23,55.24 | CN1.82 25.4,27.56 v25.02,27.94 | v19.94,35.56 19.94,51.75 19.3,52.39 v19.3,55.24 | IC2.16 44.05,53.04 v44.55,52.55
  Bottom 0.254: v6.6,55.24 v19.3,55.24 v22.23,55.24 42.01,55.24 44.55,52.7 v44.55,52.55 | v25.02,27.94 19.94,33.02 v19.94,35.56
D8  (via drill 0.3)
  Top 0.254: IC4.8 21.56,54.93 v22.52,53.98 21.56,53.98 21.21,53.62 v21.21,35.56 | CN1.80 27.94,27.56 v27.56,27.94 | v42.48,53.18 42.55,53.25 IC2.19
  Bottom 0.254: v22.52,53.98 27.24,53.98 27.88,53.34 36.45,53.34 37.08,53.98 38.35,53.98 38.99,53.34 42.32,53.34 v42.48,53.18 | v27.56,27.94 21.21,34.29 v21.21,35.56
D9  (via drill 0.3)
  Top 0.254: IC2.40 30.15,51.06 v29.15,52.07 | CN1.78 30.48,27.56 v30.1,27.94 | v22.48,35.72 v22.48,52.7 | IC4.6 20.26,55.57 19.94,55.24 19.94,52.72 v19.95,52.7
  Bottom 0.254: v19.95,52.7 v22.48,52.7 27.24,52.7 27.88,52.07 v29.15,52.07 | v30.1,27.94 30.1,28.1 v22.48,35.72
D10  (via drill 0.3)
  Top 0.254: v27.56,50.8 27.79,50.56 IC2.41 33.99,50.56 v34.07,50.64 | v33.43,27.78 33.02,27.37 CN1.76 | IC4.4 18.96,56.17 18.67,55.88 v18.67,51.45 v18.66,51.44
  Bottom 0.254: v18.66,51.44 26.92,51.44 v27.56,50.8 | v34.07,50.64 34.07,28.42 v33.43,27.78
D11  (via drill 0.3)
  Top 0.254: v27.88,49.53 27.91,49.56 IC2.43 34.99,49.56 v35.02,49.53 | v17.36,50.83 17.36,56.48 17.66,56.78 IC4.2
  Bottom 0.254: v17.36,50.83 17.39,50.8 26.61,50.8 v27.88,49.53 | v35.02,49.53 35.02,27.46 38.1,24.38 CN1.71
D12  (via drill 0.3)
  Top 0.254: v28.83,48.9 29,49.06 IC2.44 34.37,49.06 34.86,48.58 35.66,48.58 v35.81,48.74 | IC3.8 11.4,55.5 11.71,55.19 v11.71,52.07
  Bottom 0.254: v11.71,52.07 14.86,52.07 16.76,50.16 26.29,50.16 27.56,48.9 v28.83,48.9 | v35.81,48.74 35.81,27.3 40.64,22.48 CN1.69
D13  (via drill 0.3)
  Top 0.254: v29.46,48.26 29.77,48.56 IC2.45 34.24,48.56 34.7,48.1 36.45,48.1 v36.61,48.26 | IC3.6 10.1,56.65 10.41,56.34 10.41,52.07 v11.05,51.44
  Bottom 0.254: v29.46,48.26 27.56,48.26 26.29,49.53 16.13,49.53 14.22,51.44 v11.05,51.44 | v36.61,48.26 36.61,27.15 43.18,20.57 CN1.67
D14  (via drill 0.3)
  Top 0.254: v30.26,47.78 30.54,48.06 IC2.46 34.1,48.06 34.54,47.62 v37.4,47.62 | IC3.4 8.8,59.76 v8.79,59.74
  Bottom 0.254: v30.26,47.78 30.1,47.62 27.56,47.62 26.29,48.9 15.49,48.9 13.59,50.8 8.51,50.8 5.33,53.98 5.33,57.78 6.6,59.05 8.51,59.05 8.79,59.33 v8.79,59.74 | v37.4,47.62 37.4,26.99 45.72,18.67 CN1.65
D15  (via drill 0.3)
  Top 0.254: v5.33,52.07 5.33,56.52 7.5,58.69 IC3.2 | IC2.48 26.53,47.06 v25.97,47.62
  Bottom 0.254: v5.33,52.07 7.87,49.53 13.59,49.53 15.49,47.62 v25.97,47.62 27.08,46.51 31.05,46.51 31.85,47.31 31.85,50.64 32.48,51.28 38.04,51.28 38.35,50.96 38.35,26.67 48.26,16.76 CN1.63
DQ0
  Top 0.254: IC2.118 58.16,39.56 61.21,36.51 75.5,36.51 IC1.31
DQ1
  Top 0.254: IC2.117 57.07,39.06 57.09,39.05 57.72,39.05 60.9,35.88 75.5,35.88 IC1.32
DQ2
  Top 0.254: IC2.120 77.16,40.56 78.99,38.73 IC1.33
DQ3
  Top 0.254: IC2.119 75.76,40.06 77.72,38.1 77.72,36.2 IC1.34
DQ4
  Top 0.254: IC2.124 77.7,42.56 81.53,38.73 IC1.35
DQ5
  Top 0.254: IC1.36 80.26,36.2 80.26,38.73 77.93,41.06 IC2.121
DQ6
  Top 0.254: IC1.37 84.07,38.73 79.95,42.86 79.63,43.18 79.24,43.56 IC2.126
DQ7
  Top 0.254: IC1.38 82.8,36.2 82.8,38.73 78.47,43.06 IC2.125
DQ8
  Top 0.254: IC2.128 80.78,44.56 86.61,38.73 IC1.39
DQ9
  Top 0.254: IC2.116 57.26,38.56 62.17,33.66 85.34,33.66 IC1.40
DQ10
  Top 0.254: IC2.129 82.82,45.06 89.15,38.73 IC1.41
DQ11
  Top 0.254: IC2.115 56.8,38.06 61.85,33.02 87.88,33.02 89.15,34.29 IC1.42
DQ12
  Top 0.254: IC2.130 84.86,45.56 91.69,38.73 IC1.43
DQ13
  Top 0.254: IC2.113 56.85,37.06 61.53,32.38 90.42,32.38 91.69,33.66 IC1.44
DQ14
  Top 0.254: IC2.131 53.56,46.08 86.89,46.08 94.23,38.73 IC1.45
DQ15
  Top 0.254: IC2.112 56.4,36.56 61.21,31.75 92.96,31.75 94.23,33.02 IC1.46
GND  (via drill 0.3, 0.6, 0.7)
  Top 0.254: v52.25,37.57 v52.25,37.56 IC2.114 | IC2.99 v47.05,34.43 v47.04,34.44 | IC2.90 42.55,34.46 v42.25,34.76 42.05,34.56 IC2.89 | IC2.18 43.05,57.12 v43.03,57.1 | v37.57,53.29 37.55,53.31 IC2.29 | IC2.62 41.57,40.06 v42.22,39.42 | IC5.19 38.62,68.03 v38.61,68.02 | v43.82,64.29 IC5.10 | C15.2 v36.45,64.77 36.32,64.64 R2.1 | R5.1 v1.52,30.48 | IC2.36 34,54.61 v33.27,54.61 C11.2 | C9.1 52.72,33.02 v52.32,33.02 51.59,33.02 IC2.108 | IC2.123 55.34,42.06 v55.5,41.91 | IC2.72 30.87,35.06 29.22,33.41 C12.2 v28.19,32.38 | IC8.22 v2.79,46.35 | IC2.47 33.33,47.56 v33.48,47.41 | R8.2 v18.67,19.68 | R4.1 v98.04,43.18 | R1.1 v101.85,69.22 | v106.93,69.22 R6.1
  Top 0.305: C17.2 v14.86,65.41 | IC3.10 v12.7,62.21 v12.7,62.2 | IC4.10 v22.86,62.21 v22.86,62.2 | IC4.19 17.66,69.92 v17.65,69.93 | IC3.19 7.5,69.86 v7.49,69.88 | C14.2 v5.33,65.41 | IC2.144 54.37,52.56 v55.09,53.29 C10.1
  Top 0.406: C16.2 6.36,30.09 v6.6,29.84
  Top 0.61: C2.2 v31.37,59.69 | v11.13,47.09 11.05,47.17 IC8.16
  Top 0.813: 108.09,53.62 C22.2 106.27,53.73 IC7.1 106.27,52.07 v106.93,52.07 | C20.2 v113.28,58.42 | C21.2 v92.96,55.88 | v92.96,54.61 v92.96,57.15 | C23.2 v27.56,68.58
  Top 1.016: CN1.99 2.54,11.37 v2.48,11.43 | v15.18,11.43 15.24,11.37 CN1.89 | CN1.87 17.78,11.37 v17.72,11.43 | v126.94,11.75 127,11.68 CN1.1 | CN1.3 124.46,11.68 v124.4,11.75
  Bottom 1.016: v2.48,11.43 2.54,11.37 CN1.99 | CN1.89 15.24,11.37 v15.18,11.43 | v17.72,11.43 17.78,11.37 CN1.87 | CN1.85 20.32,11.37 v20.26,11.43 | CN1.73 35.56,11.05 v35.5,11.11 | v50.74,11.11 50.8,11.05 CN1.61 | CN1.49 66.04,11.05 v65.98,11.11 | v81.22,11.11 81.28,11.05 CN1.37 | CN1.1 127,11.68 v126.94,11.75 | v124.4,11.75 124.46,11.68 CN1.3 | CN1.13 111.76,11.68 v111.7,11.75 | v96.46,12.38 96.52,12.32 CN1.25
  other vias: 110.74,52.07 109.47,52.07 108.2,52.07 110.74,50.8 109.47,50.8 108.2,50.8 106.93,50.8 0.86,78.38 2.13,78.38 0.86,77.11 87.86,78.38 86.59,78.38 87.86,77.11
  pour Route2: -0.38,0 129.79,0 129.79,90.17 -0.38,90.17
  pour Top: 112.01,53.98 112.01,49.53 105.03,49.53 105.03,53.98
IDE_A0
  Top 0.254: IC5.13 42.52,69.57 44.07,71.12 45.34,71.12 IDE.35
IDE_A1
  Top 0.254: IC5.15 41.22,69.54 IDE.33
IDE_A2
  Top 0.254: IC5.14 41.87,69.56 44.07,71.75 45.11,71.75 46.46,73.1 46.46,74.78 IDE.36
IDE_CS0
  Top 0.254: IC5.11 43.82,69.6 44.07,69.85 46.61,69.85 IDE.37
IDE_CS1
  Top 0.254: IC5.12 43.17,69.58 44.07,70.48 46.61,70.48 49.15,73.03 49.15,74.93 IDE.38
IDE_IRQ  (via drill 0.3)
  Top 0.254: IDE.31 42.8,73.03 42.16,72.39 v39.62,72.39 | v37.08,69.22 36.12,69.22 35.56,68.66 35.56,63.8 35.33,63.58 35.33,61.28 R2.2 36.55,60.06 IC2.31
  Bottom 0.254: v39.62,72.39 39.62,71.75 v37.08,69.22
IDE_RST
  Top 0.254: IC5.18 39.27,69.57 37.72,71.12 32.64,71.12 31.37,72.39 31.37,76.83 30.73,77.47 4.06,77.47 3.43,76.83 3.43,74.93 IDE.1
IDE_WAIT  (via drill 0.3)
  Top 0.254: v37.08,70.48 36.03,70.48 R3.2 34.76,59.48 35.55,58.69 IC2.33
  Bottom 0.254: IDE.27 37.72,71.12 v37.08,70.48
IDED0
  Top 0.254: IC4.12 22.21,70.22 25.02,73.03 IDE.17
IDED1
  Top 0.254: IC4.14 20.91,72.09 IDE.15
IDED2
  Top 0.254: IC4.16 19.61,73.33 IDE.13
IDED3
  Top 0.254: IC4.18 18.31,72.75 IDE.11
IDED4
  Top 0.254: IC3.12 12.05,70.86 IDE.9
IDED5
  Top 0.254: IC3.14 10.75,72.09 IDE.7
IDED6
  Top 0.254: IC3.16 9.45,73.33 IDE.5
IDED7
  Top 0.254: IC3.18 8.15,72.75 IDE.3
IDED8
  Top 0.254: IC3.17 8.8,72.73 8.51,73.03 8.51,74.93 IDE.4
IDED9
  Top 0.254: IC3.15 10.1,72.08 11.05,73.03 11.05,74.93 IDE.6
IDED10
  Top 0.254: IC3.13 11.4,70.84 13.59,73.03 13.59,74.93 IDE.8
IDED11
  Top 0.254: IC3.11 12.7,69.6 16.13,73.03 16.13,74.93 IDE.10
IDED12
  Top 0.254: IC4.17 18.96,72.73 18.67,73.03 18.67,74.93 IDE.12
IDED13
  Top 0.254: IC4.15 20.26,72.08 21.21,73.03 21.21,74.93 IDE.14
IDED14
  Top 0.254: IC4.13 21.56,70.84 23.75,73.03 23.75,74.93 IDE.16
IDED15
  Top 0.254: IC4.11 22.86,69.6 26.29,73.03 26.29,74.93 IDE.18
INT2  (via drill 0.3)
  Top 0.254: v104.39,12.7 104.39,16.26 INT6/INT2.1
  Bottom 0.254: CN1.19 104.14,12.45 v104.39,12.7
INT6
  Top 0.254: CN1.22 INT6/INT2.3
INT_OUT  (via drill 0.3)
  Top 0.254: IC2.32 36.05,52.47 38.99,49.53 v51.53,49.53 | v109.47,32.38 v109.47,28.57 | v105.03,24.13 103.12,22.23 103.12,19.47 R9.2 103.12,18.63 INT6/INT2.2
  Bottom 0.254: v51.53,49.53 51.53,36.35 52.32,35.56 54.23,35.56 58.04,31.75 108.84,31.75 v109.47,32.38 | v109.47,28.57 v105.03,24.13
KEY_PIN_POWER
  Top 0.813: F1.1 31.1,65.3 C23.1 31.1,70.75 28.83,73.03 28.83,74.93 IDE.20
LAN_A0
  Top 0.254: IC2.4 50.04,54.58 50.04,56.26 55.37,61.59 74.55,61.59 75.18,62.23 75.18,64.14 IC1.5
LAN_A1
  Top 0.254: IC2.3 50.55,56.03 55.47,60.96 75.18,60.96 76.45,62.23 IC1.6
LAN_A2
  Top 0.254: IC2.6 49.05,56.77 59.91,67.63 77.72,67.63 78.99,66.36 IC1.7
LAN_A3
  Top 0.254: IC2.5 49.55,56.53 55.05,62.04 55.17,62.15 60.01,66.99 77.41,66.99 77.72,66.67 77.72,64.14 IC1.8
LAN_A4
  Top 0.254: IC2.9 47.55,56.79 59.65,68.9 78.68,68.9 81.53,66.04 IC1.9 | IC2.9
LAN_A5
  Top 0.254: IC2.7 48.55,56.98 59.83,68.26 78.04,68.26 80.26,66.04 80.26,64.14 IC1.10
LAN_A6
  Top 0.254: IC2.11 46.55,57.47 59.25,70.17 80.26,70.17 84.07,66.36 IC1.11
LAN_A7
  Top 0.254: IC2.10 47.05,57.21 59.37,69.53 59.63,69.53 59.94,69.53 79.95,69.53 82.8,66.67 82.8,64.14 IC1.12
LAN_A8
  Top 0.254: IC2.140 77.49,50.56 87.88,60.96 87.88,64.14 IC1.13
LAN_A9
  Top 0.254: IC2.142 77.22,51.56 86.61,60.96 IC1.14
LAN_A10
  Top 0.254: IC2.138 79.03,49.56 90.42,60.96 90.42,64.14 IC1.15
LAN_A11
  Top 0.254: IC2.139 78.26,50.06 89.15,60.96 IC1.16
LAN_A12
  Top 0.254: IC1.17 92.96,64.14 92.96,60.96 80.57,48.56 IC2.136
LAN_A13
  Top 0.254: IC2.137 79.8,49.06 91.69,60.96 IC1.18
LAN_CFG1
  Top 0.254: IC1.19 94.23,67.31 90.9,70.64 58.83,70.64 46.05,57.86 IC2.12
LAN_CFG3
  Top 0.254: IC1.21 96.77,69.85 95.5,71.12 58.52,71.12 45.55,58.15 IC2.13
LAN_CFG4
  Top 0.254: IC1.50 99.31,33.02 96.77,30.48 59.94,30.48 54.86,35.56 IC2.110
LAN_CGF2
  Top 0.254: IC2.135 81.34,48.06 94.23,60.96 IC1.20
LAN_CS
  Top 0.254: IC2.133 96.06,47.06 99.31,43.81 IC1.49
LAN_EN
  Top 0.254: IC2.76 35.55,34.66 36.45,35.56 42.48,35.56 43.43,34.61 45.97,34.61 46.61,35.24 47.24,35.24 47.88,34.61 52.01,34.61 52.64,33.97 53.91,33.97 54.23,33.66 54.23,31.11 55.5,29.84 98.68,29.84 101.85,33.02 IC1.52
LAN_INT
  Top 0.254: IC2.111 55.63,36.06 60.58,31.11 94.87,31.11 96.77,33.02 IC1.48 98.04,36.2 R4.2
LAN_RD
  Top 0.254: IC1.51 101.85,43.81 98.1,47.56 IC2.134
LAN_WRH
  Top 0.254: IC1.47 96.77,38.73 89.47,46.04 89.15,46.35 88.94,46.56 IC2.132
LEDA
  Top 0.254: LEDA.2 IC1.23
LEDB
  Top 0.254: IC1.24 99.31,63.5 100.58,64.77 100.58,66.04 104.39,69.85 LEDB.2
N$1
  Top 0.254: LEDA.1 R1.2
N$2
  Top 0.254: LEDB.1 R6.2
N$40  (via drill 0.3)
  Top 0.254: IC2.68 29.06,37.06 25.65,33.66 v16.76,33.66 | v18.67,27.94 18.67,25.53 SJ1.1
  Bottom 0.254: v16.76,33.66 16.76,29.84 v18.67,27.94
N$42
  Top 0.254: IDE_ACT.1 R7.2
R/W
  Top 0.254: IC2.83 39.05,22.8 43.18,18.67 CN1.68
ROM_B0  (via drill 0.3)
  Top 0.254: IC8.3 12.32,34.29 12.95,33.66 v15.49,33.66 | R8.1 15.91,22.01 JP1.1 16.13,24.26 SJ1.2 17.4,25.53 v17.4,27.3
  Bottom 0.254: v15.49,33.66 15.49,29.21 v17.4,27.3
ROM_B1
  Top 0.254: IC2.69 29.2,36.56 25.65,33.02 12.32,33.02 11.05,34.29 IC8.2
ROM_B2
  Top 0.254: IC8.1 9.78,33.66 11.05,32.38 25.65,32.38 29.33,36.06 IC2.70
ROM_B3
  Top 0.254: IC2.71 29.47,35.56 25.65,31.75 11.68,31.75 9.14,29.21 5.97,29.21 5.33,29.84 5.33,31.75 5.97,32.38 IC8.30
ROM_OE  (via drill 0.3)
  Top 0.254: IC8.24 3.43,43.81 2.79,44.45 2.79,45.36 3.15,45.72 11.68,45.72 14.22,48.26 v14.22,57.15 | IC2.35 34.55,56.51 33.91,57.15 v33.27,57.15
  Bottom 0.254: v14.22,57.15 v33.27,57.15
ROM_WE  (via drill 0.3)
  Top 0.254: IC8.31 7.24,37.47 6.6,38.1 2.79,38.1 2.16,38.73 2.16,46.66 2.49,46.99 5.97,46.99 6.6,46.35 11.68,46.35 12.95,47.62 v12.95,60.48 | IC2.34 35.05,57.91 v33.91,59.05
  Bottom 0.254: v33.91,59.05 32.48,60.48 v12.95,60.48
TCK  (via drill 0.3)
  Top 0.254: v27.56,36.83 28.19,36.83 28.93,37.56 IC2.67 | RN1.1 5.45,62.12 4.06,63.5 SV2.9
  Bottom 0.254: SV2.9 2.49,62.56 2.49,49.52 2.95,49.05 6.13,49.05 7.08,48.1 12.48,48.1 16.13,44.45 26.29,44.45 27.24,43.5 27.24,37.15 v27.56,36.83
TDI  (via drill 0.3)
  Top 0.254: v30.58,39.85 30.87,39.56 IC2.63 | v4.06,50.16 2.49,51.74 2.49,57.48 SV2.5 4.91,59.9 RN1.3
  Bottom 0.254: v30.58,39.85 v30.57,39.85 28.19,42.23 28.19,43.81 26.29,45.72 16.61,45.72 13.27,49.05 7.72,49.05 6.6,50.16 v4.06,50.16
TDO  (via drill 0.3)
  Top 0.254: SV2.3 3.02,55.47 3.02,53.11 v4.06,52.07 | IC2.122 52.03,41.56 51.53,42.07 51.53,47.15 v49.78,48.9
  Bottom 0.254: v49.78,48.9 49.78,50.16 48.83,51.12 40.26,51.12 39.62,51.75 32,51.75 31.37,51.12 31.37,47.62 30.73,46.99 27.56,46.99 26.29,48.26 15.49,48.26 13.59,50.16 8.51,50.16 5.97,52.7 4.7,52.7 v4.06,52.07
TMS  (via drill 0.3)
  Top 0.254: v28.22,38.46 28.33,38.56 IC2.65 | RN1.2 4.96,60.7 SV2.7
  Bottom 0.254: SV2.7 3.02,60.55 3.02,49.76 3.25,49.53 6.45,49.53 7.4,48.58 12.95,48.58 16.45,45.09 26.29,45.09 27.72,43.66 27.72,38.89 28.16,38.46 v28.22,38.46
Z3  (via drill 0.3)
  Top 0.254: IC2.79 37.05,30.45 35.18,28.57 17.4,28.57 v14.22,25.4
  Bottom 0.254: v14.22,25.4 12.7,23.88 CN1.91

### Text on the board
Top: TOP
Bottom: BOT
tNames: + | + | + | ZORRO-IDE-LAN V0.1 / (C) Matthias Heinrichs 2016 | - +